# Altium project Netscale48HD_Sensorbar.PrjPcb (part 1 of 2)
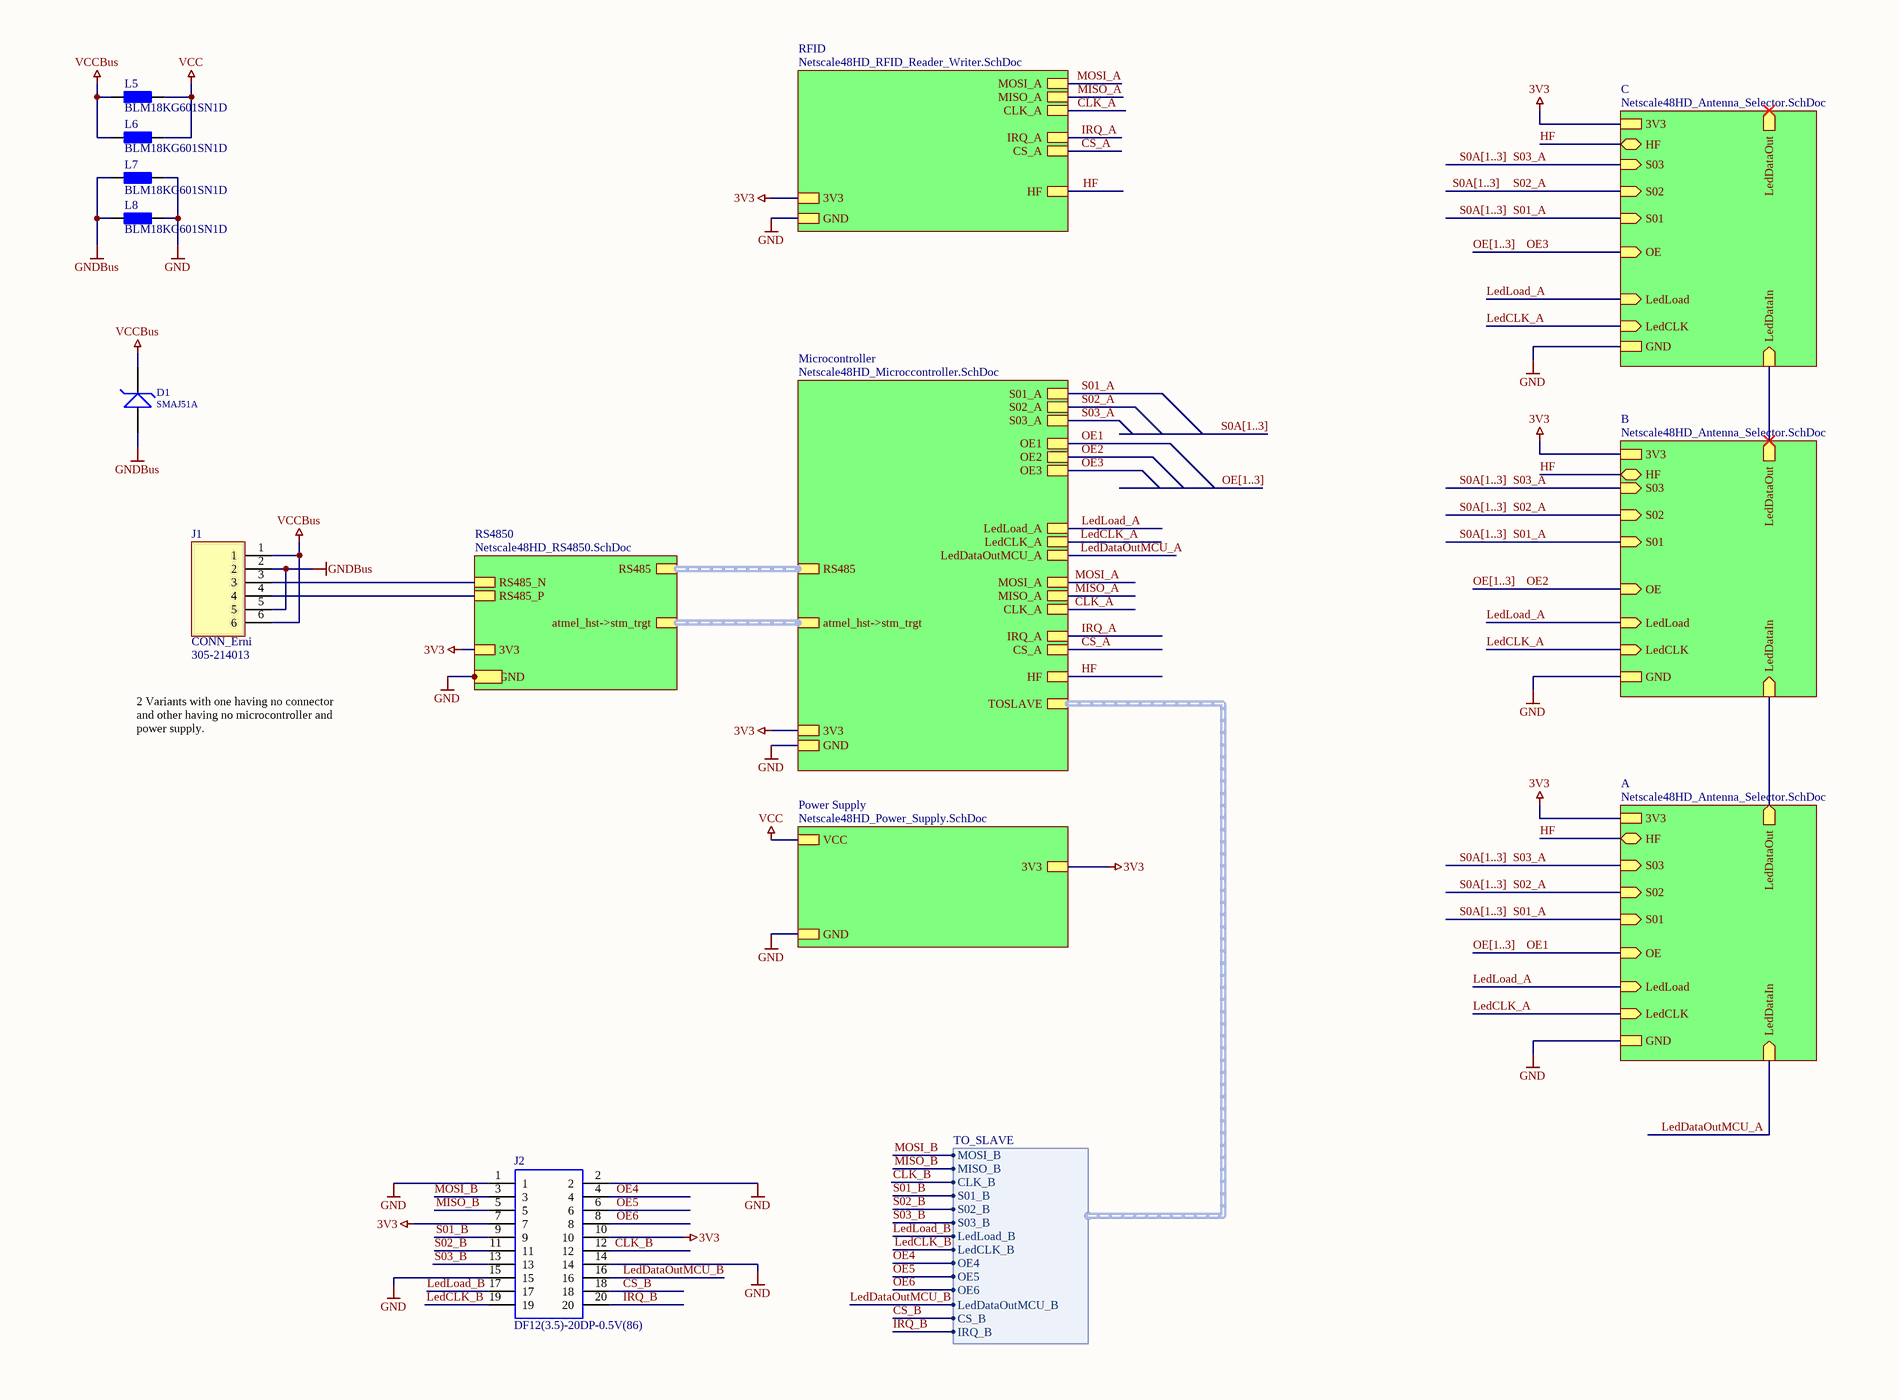
[diagram p0: Netscale48HD_Sensorbar.SchDoc, top]
6 sheets, 299 parts. Net scope: hierarchical (ports join the sheet entries above them; power ports are global).
Board file: Netscale48HD_Sensorbar_Master.PcbDoc
Sheets:
  Netscale48HD_Sensorbar.SchDoc
    Microcontroller = Netscale48HD_Microccontroller.SchDoc
    RS4850 = Netscale48HD_RS4850.SchDoc
    A = Netscale48HD_Antenna_Selector.SchDoc
    B = Netscale48HD_Antenna_Selector.SchDoc
    C = Netscale48HD_Antenna_Selector.SchDoc
    RFID = Netscale48HD_RFID_Reader_Writer.SchDoc
    Power Supply = Netscale48HD_Power_Supply.SchDoc

## Sheet Netscale48HD_Sensorbar.SchDoc: Sensorbar Master Overall Schematic
size A3; CompanyName: Reichle & De-Massari; Organization: Reichle & De-Massari; Address1: Binzstrasse 32; Address2: 8620 Wetzikon; Address3: Switzerland; DocumentNumber: 1; Revision: V0.2; SheetNumber: 1; SheetTotal: 5

### Parts
D1  SMAJ51A  [Bourns_DO-214AC (SMA) small_2_R]
J1  CONN_Erni  Supplier Part Number 1: 305-214013  [ERNI_214013 Randmontage_6_R]
J2  DF12(3.5)-20DP-0.5V(86)  [DF12(4.0)-20DP]
L5  BLM18KG601SN1D  [CAP-0603[1608] - RFL]
L6  BLM18KG601SN1D  [CAP-0603[1608] - RFL]
L7  BLM18KG601SN1D  [CAP-0603[1608] - RFL]
L8  BLM18KG601SN1D  [CAP-0603[1608] - RFL]

### Sub-sheets
A = Netscale48HD_Antenna_Selector.SchDoc: 3V3, S03 (in), S02 (in), S01 (in), HF (bidir), LedLoad (in), LedCLK (in), GND, LedDataOut (out), LedDataIn (in), OE (in)
B = Netscale48HD_Antenna_Selector.SchDoc: 3V3, S03 (in), S02 (in), S01 (in), HF (bidir), LedLoad (in), LedCLK (in), GND, LedDataOut (out), LedDataIn (in), OE (in)
C = Netscale48HD_Antenna_Selector.SchDoc: 3V3, S03 (in), S02 (in), S01 (in), HF (bidir), LedLoad (in), LedCLK (in), GND, LedDataOut (out), LedDataIn (in), OE (in)
Microcontroller = Netscale48HD_Microccontroller.SchDoc: GND, LedLoad_A, RS485 (harness RS485), 3V3, LedCLK_A, LedDataOutMCU_A, CS_A, S01_A, S02_A, S03_A, OE1, OE2, OE3, IRQ_A, HF, atmel_hst->stm_trgt (harness atmel_hst->stm_trgt), MOSI_A, MISO_A, CLK_A, TOSLAVE (harness TO_SLAVE)
Power Supply = Netscale48HD_Power_Supply.SchDoc: VCC, GND, 3V3
RFID = Netscale48HD_RFID_Reader_Writer.SchDoc: MOSI_A, MISO_A, 3V3, GND, IRQ_A, HF, CS_A, CLK_A
RS4850 = Netscale48HD_RS4850.SchDoc: GND, 3V3, RS485 (harness RS485), RS485_N, RS485_P, atmel_hst->stm_trgt (harness atmel_hst->stm_trgt)

### Ports


### Harnesses
TO_SLAVE: MOSI_B, MISO_B, CLK_B, S01_B, S02_B, S03_B, LedLoad_B, LedCLK_B, OE4, OE5, OE6, LedDataOutMCU_B, CS_B, IRQ_B

### Nets
3V3: J2.7 J2.10 ; sheet Microcontroller/3V3, sheet RS4850/3V3, sheet A/3V3, sheet B/3V3, sheet C/3V3, sheet RFID/3V3, sheet Power Supply/3V3
GND: J2.1 J2.2 J2.14 J2.15 L7.2 L8.2 ; port , sheet Microcontroller/GND, sheet RS4850/GND, sheet A/GND, sheet B/GND, sheet C/GND, sheet RFID/GND, sheet Power Supply/GND
GNDBus: D1.2(A) J1.2 J1.5 L7.1 L8.1
VCC: L5.2 L6.2 ; sheet Power Supply/VCC
VCCBus: D1.1(K) J1.1 J1.6 L5.1 L6.1
CLK_A: sheet Microcontroller/CLK_A, sheet RFID/CLK_A
CLK_B: J2.12 ; sheet Microcontroller/TOSLAVE.CLK_B
CS_A: sheet Microcontroller/CS_A, sheet RFID/CS_A
CS_B: J2.18 ; sheet Microcontroller/TOSLAVE.CS_B
HF: sheet Microcontroller/HF, sheet A/HF, sheet B/HF, sheet C/HF, sheet RFID/HF
IRQ_A: sheet Microcontroller/IRQ_A, sheet RFID/IRQ_A
IRQ_B: J2.20 ; sheet Microcontroller/TOSLAVE.IRQ_B
LedCLK_A: sheet Microcontroller/LedCLK_A, sheet A/LedCLK, sheet B/LedCLK, sheet C/LedCLK  [project net LedCLK]
LedCLK_B: J2.19 ; sheet Microcontroller/TOSLAVE.LedCLK_B
LedDataIn: sheet A/LedDataOut, sheet B/LedDataIn
LedDataIn: sheet B/LedDataOut, sheet C/LedDataIn  [a separate net that carries the same name]
LedDataOutMCU_A: sheet Microcontroller/LedDataOutMCU_A, sheet A/LedDataIn  [project net LedDataIn]
LedDataOutMCU_B: J2.16 ; sheet Microcontroller/TOSLAVE.LedDataOutMCU_B
LedLoad_A: sheet Microcontroller/LedLoad_A, sheet A/LedLoad, sheet B/LedLoad, sheet C/LedLoad  [project net LedLoad]
LedLoad_B: J2.17 ; sheet Microcontroller/TOSLAVE.LedLoad_B
MISO_A: sheet Microcontroller/MISO_A, sheet RFID/MISO_A
MISO_B: J2.5 ; sheet Microcontroller/TOSLAVE.MISO_B
MOSI_A: sheet Microcontroller/MOSI_A, sheet RFID/MOSI_A
MOSI_B: J2.3 ; sheet Microcontroller/TOSLAVE.MOSI_B
OE1: sheet Microcontroller/OE1, sheet A/OE  [project net OE]
OE2: sheet Microcontroller/OE2, sheet B/OE  [project net OE]
OE3: sheet Microcontroller/OE3, sheet C/OE  [project net OE]
OE4: J2.4 ; sheet Microcontroller/TOSLAVE.OE4
OE5: J2.6 ; sheet Microcontroller/TOSLAVE.OE5
OE6: J2.8 ; sheet Microcontroller/TOSLAVE.OE6
RS485_0_N: J1.3 ; sheet RS4850/RS485_N
RS485_0_P: J1.4 ; sheet RS4850/RS485_P
S01_A: sheet Microcontroller/S01_A, sheet A/S01, sheet B/S01, sheet C/S01  [project net S01]
S01_B: J2.9 ; sheet Microcontroller/TOSLAVE.S01_B
S02_A: sheet Microcontroller/S02_A, sheet A/S02, sheet B/S02, sheet C/S02  [project net S02]
S02_B: J2.11 ; sheet Microcontroller/TOSLAVE.S02_B
S03_A: sheet Microcontroller/S03_A, sheet A/S03, sheet B/S03, sheet C/S03  [project net S03]
S03_B: J2.13 ; sheet Microcontroller/TOSLAVE.S03_B

### Buses and harness runs
bus OE[1..3]
bus S0A[1..3]
harness sheet Microcontroller/atmel_hst->stm_trgt = sheet RS4850/atmel_hst->stm_trgt
harness sheet Microcontroller/RS485 = sheet RS4850/RS485

### Notes on the sheet
- 10,8
- 16,8
- 7
- 212,4
- 2 Variants with one having no connector and other having no microcontroller and power supply.
- Title
- Size:
- Date:
- A3
- Number:
- Time:
- Revision:
- Sheet
- of
- File:

### Library data of the parts
D1 = Diode_SMAJ51A: ESD Suppressors / TVS Diodes 51volts 5uA 4.9 Amps Uni-Dir; Manufacturer: Bourns; Replaceable: yes; Manufacturer PartNr: SMAJ51A; ShortDescription: SMAJ51A; Footprint/Package: DO-214AC-2 (SMA); Supplier 1: Mouser; Supplier Part Number 1: 652-SMAJ51A; value: SMAJ51A
J1 = CONN_Erni_6_214013: Headers & Wire Housings 6P 1.27MM SNGL ROW R/A MALE BLK; Manufacturer: ERNI; Manufacturer PartNr: 214013; Replaceable: no; ComponentLink1Description: mouser; ComponentLink1URL: https://www.mouser.ch/ProductDetail/ERNI/214013?qs=sGAEpiMZZMvMXbh32ZmHAMhEPQG9jaj7Ou3J%2fuOb4IQ%3d; Footprint/Package: 1.27mm; Supplier 1: Mouser
J2 = DF12(3.5)-20DP-0.5V(86): Connector,Board to Board,DF12 Hirose DF12 Series, 0.5mm Pitch 20 Way 2 Row Straight PCB Header, Solder Termination, 0.3A; Allied_Number: R1051072; Manufacturer_Name: Hirose; Manufacturer_Part_Number: DF12(3.5)-20DP-0.5V(86); RS Part Number: 6082064P; RS Price/Stock: http://uk.rs-online.com/web/p/products/6082064P; Allied Price/Stock: http://www.alliedelec.com/hirose-electric-df12-3-5-20dp-0-5v-86-/R1051072/; Mouser Part Number: 798-DF123520DP0.5V86; Mouser Price/Stock: https://www.mouser.com/Search/Refine.aspx?Keyword=798-DF123520DP0.5V86; Datasheet Link: https://www.hirose.com/product/en/download_file/key_name/DF12/category/Catalog/doc_file_id/31693/?file_category_id=4&item_id=23&is_series=1.pdf; Supplier 1: Digi-Key; Supplier 1 Part Number 1: H5230TR-ND
L5-L8 = Ferrite Beads: Chip Ferrite Bead; Manufacturer: Murata; Manufacturer PartNr: BLM18KG601SN1D; ShortDescription: BLM18KG601SN1D

## Sheet Netscale48HD_Microccontroller.SchDoc: STM32 Microcontroller
size A3; Organization: Reichle & De-Massari; Address1: Binzstrasse 32; Address2: 8620 Wetzikon; Address3: Switzerland; DocumentNumber: 5; Revision: V0.2; SheetNumber: 5; SheetTotal: 5
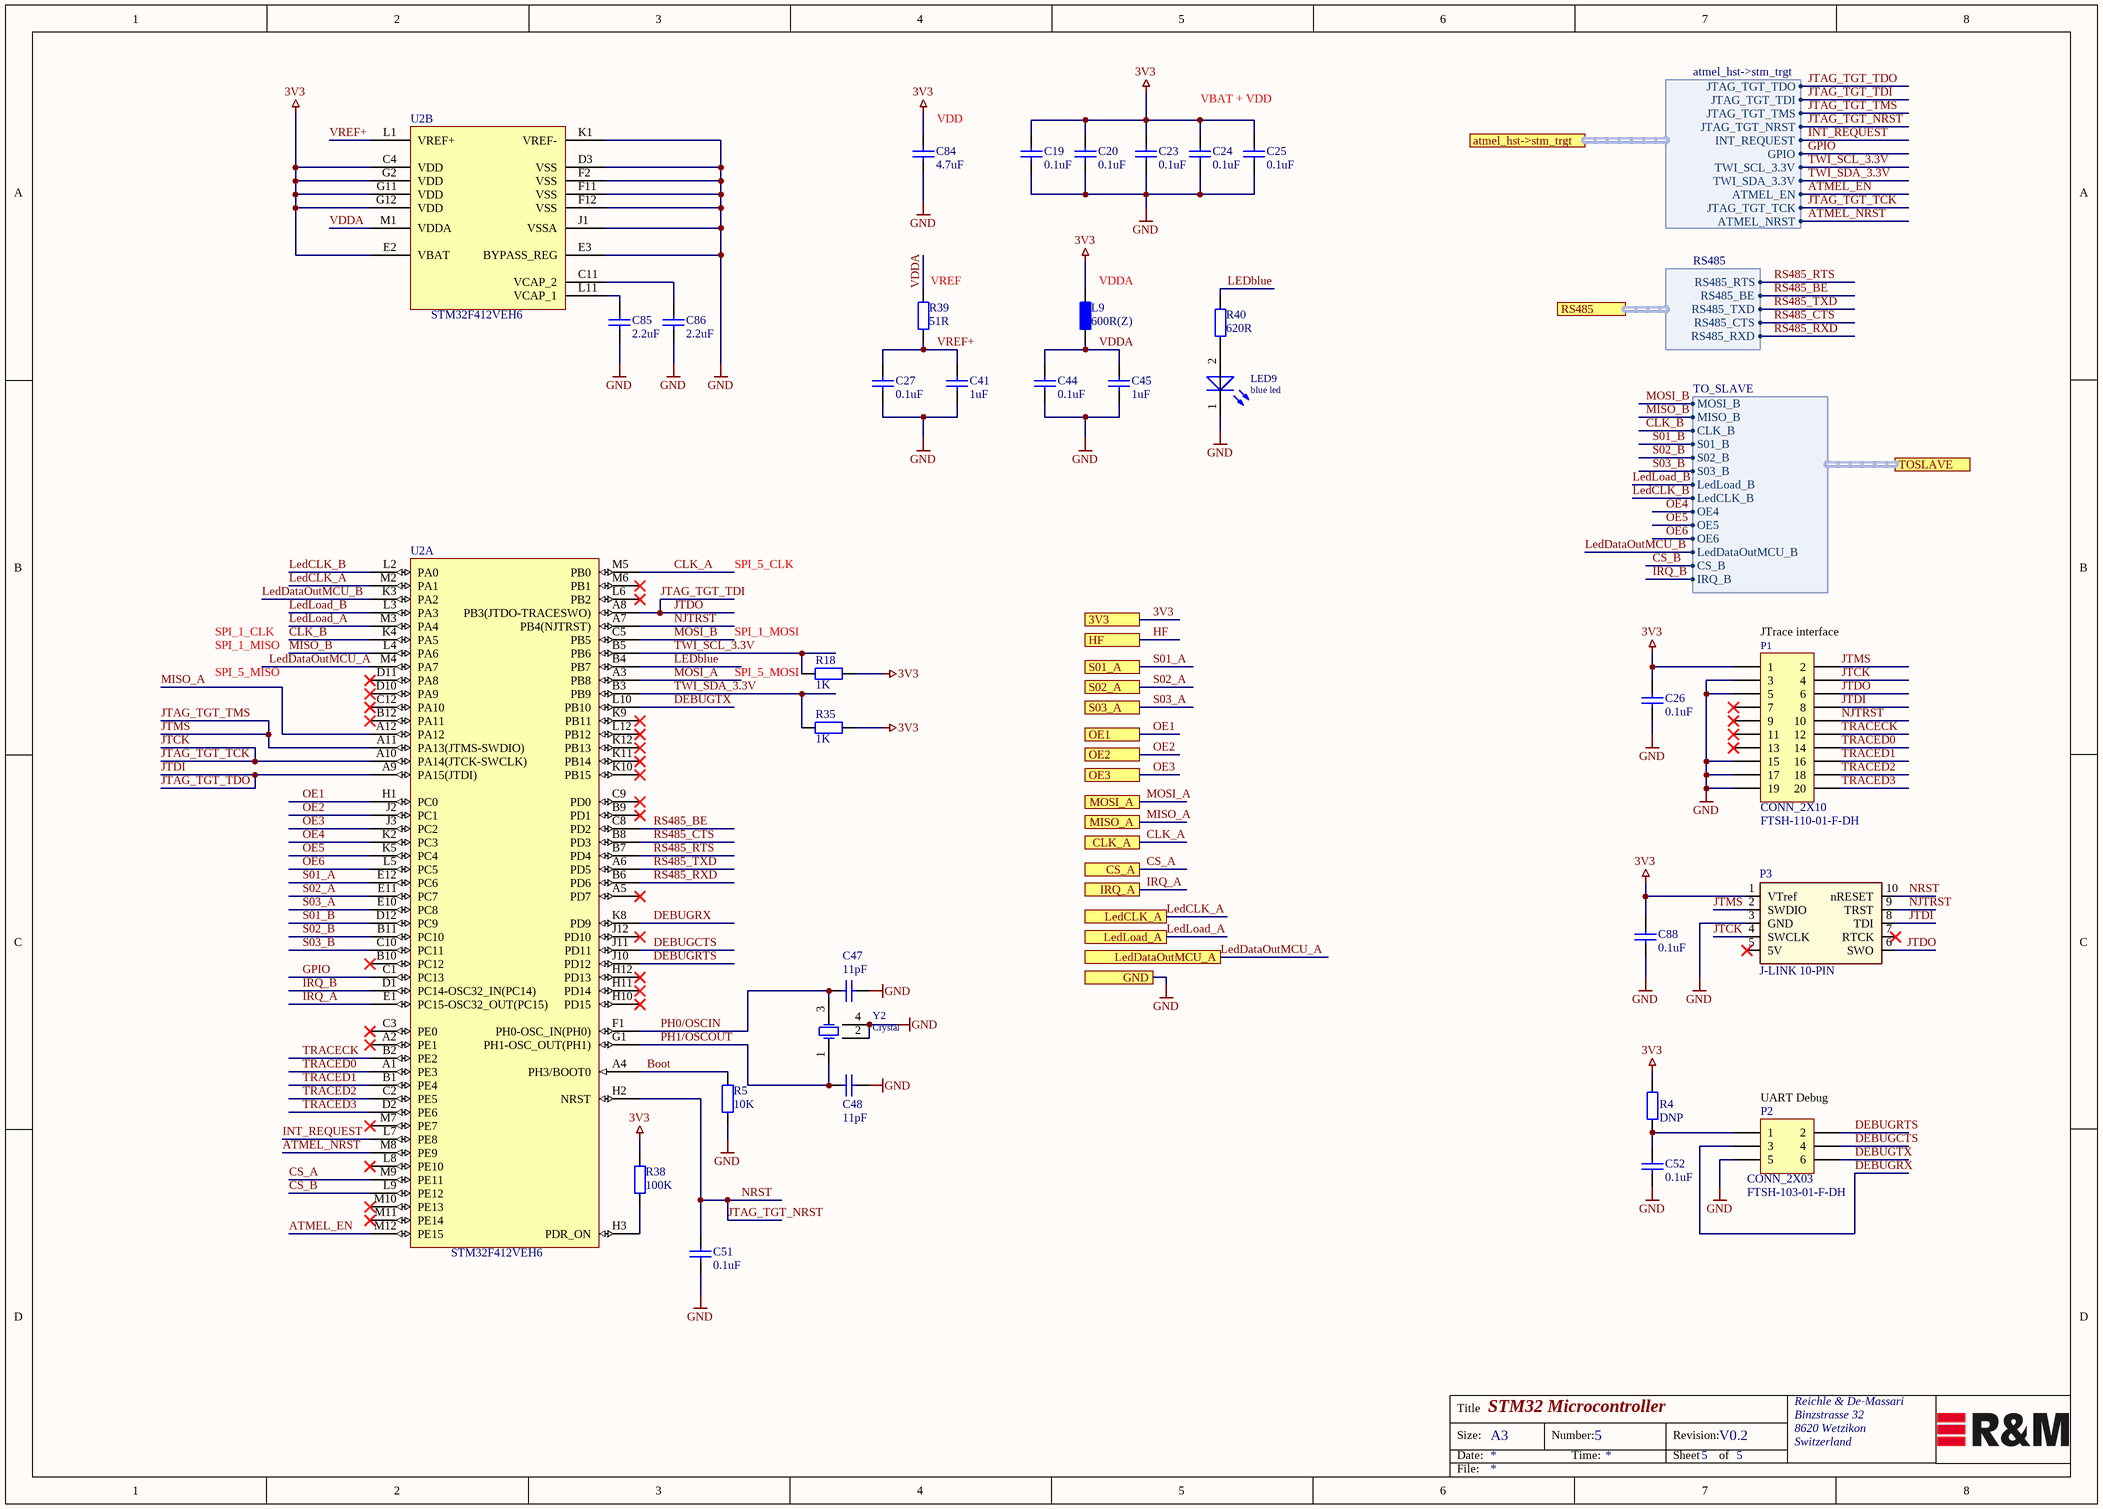
[diagram p1: Netscale48HD_Microccontroller.SchDoc]

### Parts
C19  0.1uF  [Ceramic Capacitor 0402 EIA]
C20  0.1uF  [Ceramic Capacitor 0402 EIA]
C23  0.1uF  [Ceramic Capacitor 0402 EIA]
C24  0.1uF  [Ceramic Capacitor 0402 EIA]
C25  0.1uF  [Ceramic Capacitor 0402 EIA]
C26  0.1uF  [CAPC1005X55N]
C27  0.1uF  [Ceramic Capacitor 0402 EIA]
C41  1uF  [Ceramic Capacitor 0402 EIA]
C44  0.1uF  [Ceramic Capacitor 0402 EIA]
C45  1uF  [Ceramic Capacitor 0402 EIA]
C47  11pF  [CAPC0402(1005)60_L]
C48  11pF  [CAPC0402(1005)60_L]
C51  0.1uF  [Ceramic Capacitor 0402 EIA]
C52  0.1uF  [Ceramic Capacitor 0402 EIA]
C84  4.7uF  [Ceramic Capacitor 0603 EIA]
C85  2.2uF  [Ceramic Capacitor 0402 EIA]
C86  2.2uF  [Ceramic Capacitor 0402 EIA]
C88  0.1uF  [Ceramic Capacitor 0402 EIA]
L9  600R(Z)  [Inductor 0603 EIA]
LED9  blue led  [Kingbright_SMD_2_RWH]
P1  CONN_2X10  [FTSH-110-01-F-DH]
P2  CONN_2X03  [FTSH-103-01-F-DH]
P3  J-LINK 10-PIN  [CONN-SEGGER-10-PIN]
R4  DNP  [RESC1005X40N]
R5  10K  [RES-0402[1005] - RFL]
R18  1K  [Resistor 0402 EIA]
R35  1K  [Resistor 0402 EIA]
R38  100K  [Resistor 0402 EIA]
R39  51R  [Resistor 0402 EIA]
R40  620R  [Resistor 0402 EIA]
U2  STM32F412VEH6  [STM_UFBGA100 7x7x0.6_100_R]  (parts A,B of 2)
Y2  Crystal  [ECS_ECX-2236_4_R]

### Ports
3V3, atmel_hst->stm_trgt (harness atmel_hst->stm_trgt), CLK_A, CS_A, GND, HF, IRQ_A, LedCLK_A, LedDataOutMCU_A, LedLoad_A, MISO_A, MOSI_A, OE1, OE2, OE3, RS485 (harness RS485), S01_A, S02_A, S03_A, TOSLAVE (harness TO_SLAVE)

### Harnesses
atmel_hst->stm_trgt: JTAG_TGT_TDO, JTAG_TGT_TDI, JTAG_TGT_TMS, JTAG_TGT_NRST, INT_REQUEST, GPIO, TWI_SCL_3.3V, TWI_SDA_3.3V, ATMEL_EN, JTAG_TGT_TCK, ATMEL_NRST
RS485: RS485_RXD, RS485_CTS, RS485_TXD, RS485_BE, RS485_RTS
TO_SLAVE: MOSI_B, MISO_B, CLK_B, S01_B, S02_B, S03_B, LedLoad_B, LedCLK_B, OE4, OE5, OE6, LedDataOutMCU_B, CS_B, IRQ_B

### Nets
3V3: C19.2 C20.2 C23.2 C24.2 C25.2 C26.2 C84.2 C88.2 L9.1 P1.1 P3.1(VTref) R4.2 R18.2 R35.2 R38.1 U2.C4(VDD) U2.E2(VBAT) U2.G2(VDD) U2.G11(VDD) U2.G12(VDD) ; port 3V3
GND: C19.1 C20.1 C23.1 C24.1 C25.1 C26.1 C27.1 C41.1 C44.1 C45.1 C47.2 C48.2 C51.1 C52.1 C84.1 C85.1 C86.1 C88.1 LED9.1(K) P1.3 P1.5 P1.15 P1.17 P1.19 P2.5 P3.3(GND) R5.2 U2.D3(VSS) U2.E3(BYPASS_REG) U2.F2(VSS) U2.F11(VSS) U2.F12(VSS) U2.J1(VSSA) U2.K1(VREF-) Y2.2(OSC2) Y2.4(OSC3) ; port GND
ATMEL_EN: U2.M12(PE15) ; port atmel_hst->stm_trgt.ATMEL_EN
ATMEL_NRST: U2.M8(PE9) ; port atmel_hst->stm_trgt.ATMEL_NRST
Boot: R5.1 U2.A4(PH3/BOOT0)
CLK_A: U2.M5(PB0) ; port CLK_A
CLK_B: U2.K4(PA5) ; port TOSLAVE.CLK_B
CS_A: U2.M9(PE11) ; port CS_A
CS_B: U2.L9(PE12) ; port TOSLAVE.CS_B
DEBUGCTS: P2.4 U2.J11(PD11)
DEBUGRTS: P2.2 U2.J10(PD12)
DEBUGRX: P2.3 U2.K8(PD9)
DEBUGTX: P2.6 U2.L10(PB10)
GPIO: U2.C1(PC13) ; port atmel_hst->stm_trgt.GPIO
INT_REQUEST: U2.L7(PE8) ; port atmel_hst->stm_trgt.INT_REQUEST
IRQ_A: U2.E1(PC15-OSC32_OUT(PC15)) ; port IRQ_A
IRQ_B: U2.D1(PC14-OSC32_IN(PC14)) ; port TOSLAVE.IRQ_B
JTAG_TGT_NRST: C51.2 P3.10(nRESET) U2.H2(NRST) ; port atmel_hst->stm_trgt.JTAG_TGT_NRST  [also labelled NRST]
JTAG_TGT_TCK: P1.4 P3.4(SWCLK) U2.A10(PA14(JTCK-SWCLK)) ; port atmel_hst->stm_trgt.JTAG_TGT_TCK  [also labelled JTCK]
JTAG_TGT_TDI: P1.6 P3.6(SWO) U2.A8(PB3(JTDO-TRACESWO)) ; port atmel_hst->stm_trgt.JTAG_TGT_TDI  [also labelled JTDO]
JTAG_TGT_TDO: P1.8 P3.8(TDI) U2.A9(PA15(JTDI)) ; port atmel_hst->stm_trgt.JTAG_TGT_TDO  [also labelled JTDI]
JTAG_TGT_TMS: P1.2 P3.2(SWDIO) U2.A11(PA13(JTMS-SWDIO)) ; port atmel_hst->stm_trgt.JTAG_TGT_TMS  [also labelled JTMS]
LEDblue: R40.1 U2.B4(PB7)
LedCLK_A: U2.M2(PA1) ; port LedCLK_A  [project net LedCLK]
LedCLK_B: U2.L2(PA0) ; port TOSLAVE.LedCLK_B
LedDataOutMCU_A: U2.M4(PA7) ; port LedDataOutMCU_A  [project net LedDataIn]
LedDataOutMCU_B: U2.K3(PA2) ; port TOSLAVE.LedDataOutMCU_B
LedLoad_A: U2.M3(PA4) ; port LedLoad_A  [project net LedLoad]
LedLoad_B: U2.L3(PA3) ; port TOSLAVE.LedLoad_B
MISO_A: U2.A12(PA12) ; port MISO_A
MISO_B: U2.L4(PA6) ; port TOSLAVE.MISO_B
MOSI_A: U2.A3(PB8) ; port MOSI_A
MOSI_B: U2.C5(PB5) ; port TOSLAVE.MOSI_B
NJTRST: P1.10 P3.9(TRST) U2.A7(PB4(NJTRST))
OE1: U2.H1(PC0) ; port OE1  [project net OE]
OE2: U2.J2(PC1) ; port OE2  [project net OE]
OE3: U2.J3(PC2) ; port OE3  [project net OE]
OE4: U2.K2(PC3) ; port TOSLAVE.OE4
OE5: U2.K5(PC4) ; port TOSLAVE.OE5
OE6: U2.L5(PC5) ; port TOSLAVE.OE6
PH0/OSCIN: C47.1 U2.F1(PH0-OSC_IN(PH0)) Y2.3(OSC2)
PH1/OSCOUT: C48.1 U2.G1(PH1-OSC_OUT(PH1)) Y2.1(OSC1)
RS485_BE: U2.C8(PD2) ; port RS485.RS485_BE
RS485_CTS: U2.B8(PD3) ; port RS485.RS485_CTS
RS485_RTS: U2.B7(PD4) ; port RS485.RS485_RTS
RS485_RXD: U2.B6(PD6) ; port RS485.RS485_RXD
RS485_TXD: U2.A6(PD5) ; port RS485.RS485_TXD
S01_A: U2.E12(PC6) ; port S01_A  [project net S01]
S01_B: U2.D12(PC9) ; port TOSLAVE.S01_B
S02_A: U2.E11(PC7) ; port S02_A  [project net S02]
S02_B: U2.B11(PC10) ; port TOSLAVE.S02_B
S03_A: U2.E10(PC8) ; port S03_A  [project net S03]
S03_B: U2.C10(PC11) ; port TOSLAVE.S03_B
TRACECK: P1.12 U2.B2(PE2)
TRACED0: P1.14 U2.A1(PE3)
TRACED1: P1.16 U2.B1(PE4)
TRACED2: P1.18 U2.C2(PE5)
TRACED3: P1.20 U2.D2(PE6)
TWI_SCL_3.3V: R18.1 U2.B5(PB6) ; port atmel_hst->stm_trgt.TWI_SCL_3.3V
TWI_SDA_3.3V: R35.1 U2.B3(PB9) ; port atmel_hst->stm_trgt.TWI_SDA_3.3V
VDDA: C44.2 C45.2 L9.2 R39.1 U2.M1(VDDA)
VREF+: C27.2 C41.2 R39.2 U2.L1(VREF+)
NetC52_2: C52.2 P2.1 R4.1
NetC85_2: C85.2 U2.L11(VCAP_1)
NetC86_2: C86.2 U2.C11(VCAP_2)
NetLED9_2: LED9.2(A) R40.2
NetR38_2: R38.2 U2.H3(PDR_ON)

Not connected (* = marked no-connect by the designer): P1 7* 9* 11* 13*; P3 5(5V)* 7(RTCK)*; U2 A2(PE1)* A5(PD7)* B9(PD1)* B10(PC12)* B12(PA11)* C3(PE0)* C9(PD0)* C12(PA10)* D10(PA9)* D11(PA8)* H10(PD15)* H11(PD14)* H12(PD13)* J12(PD10)* K9(PB11)* K10(PB15)* K11(PB14)* K12(PB13)* L6(PB2)* L8(PE10)* L12(PB12)* M6(PB1)* M7(PE7)* M10(PE13)* M11(PE14)*

### Notes on the sheet
- VBAT + VDD
- (near C84) VDD
- (near R39) VREF
- (near L9) VDDA
- SPI_5_CLK
- SPI_1_CLK
- SPI_1_MISO
- (near R18) SPI_1_MOSI
- (near P1) JTrace interface
- SPI_5_MISO
- (near R18) SPI_5_MOSI
- (near P2) UART Debug
- Title
- Size:
- Date:
- A3
- Number:
- Time:
- Revision:
- Sheet
- of
- File:

### Library data of the parts
C19 C20 C23-C25 C27 C44 C51 C88 = Cap_0.1uF_0402: SMD/SMT WCAP-CSGP 0.1uF 0402 20% 10V MLCC; Manufacturer: Wurth Electronics; Manufacturer PartNr: 885012105010; voltage: 10VDC; Replaceable: yes; Dielectric Grade: X5R; value: 0.1uF; tolerance: 20%; Footprint/Package: 0402; ComponentLink1Description: mouser; ComponentLink1URL: https://www.mouser.ch/ProductDetail/Wurth-Electronics/885012105010?qs=sGAEpiMZZMs0AnBnWHyRQEGbLOF2VP1ihL84oCjXnlO407YOHi%2fQbw%3d%3d; Supplier 1: Mouser; Supplier 2: Farnell; Supplier 3: Digi-Key; Supplier Part Number 1: 710-885012105010; Supplier Part Number 2: 2533928; Supplier Part Number 3: 732-7487-1-ND
C26 C52 = Cap_0.1uF_0402: SMD/SMT WCAP-CSGP 0.1uF 0402 20% 10V MLCC; Manufacturer: Wurth Electronics; Manufacturer PartNr: 885012105010; voltage: 10VDC; Dielectric Grade: X5R; Replaceable: yes; value: 0.1uF; tolerance: 20%; ComponentLink1Description: mouser; ComponentLink1URL: https://www.mouser.ch/ProductDetail/Wurth-Electronics/885012105010?qs=sGAEpiMZZMs0AnBnWHyRQEGbLOF2VP1ihL84oCjXnlO407YOHi%2fQbw%3d%3d; Footprint/Package: 0402; Supplier 1: Mouser; Supplier 2: Farnell; Supplier Part Number 1: 710-885012105010; Supplier Part Number 2: 2533928; Supplier 3: Digi-Key; Supplier Part Number 3: 732-7487-1-ND
C41 C45 = Cap_1uF_0402: SMD/SMT 0402 1uF 10volts X7S 10%; Manufacturer: Murata; Manufacturer PartNr: GCM155C71A105KE38D; voltage: 10VDC; Replaceable: yes; value: 1uF; tolerance: 10%; Footprint/Package: 0402 (1005 metric); Dielectric Grade: X7S; ComponentLink1Description: mouser; ComponentLink1URL: https://www.mouser.ch/ProductDetail/Murata-Electronics/GCM155C71A105KE38D?qs=sGAEpiMZZMsh%252b1woXyUXj0FEAttKcN54ouz5zO04smg%3d; Supplier Part Number 1: 490-13409-1-ND; Supplier 1: Digi-Key
C47 C48 = Cap_11pF_0402: SMD/SMT 0402 11pF 50volts C0G 5%; Manufacturer: Murata; Manufacturer PartNr: GRM1555C1H110JA01D; voltage: 50VDC; Dielectric Grade: C0G (NP0); Replaceable: yes; value: 11pF; tolerance: 5%; ComponentLink1Description: mouser; ComponentLink1URL: https://www.mouser.ch/ProductDetail/Murata-Electronics/GRM1555C1H110JA01D?qs=%2fha2pyFadug34NHqLs7eMMmZ4IY%2fB%2fBwtGmZmE%252bqlNJIuNiWKDU4cio3ILTIjZ7Z; Footprint/Package: 0402; Supplier 1: Mouser; Supplier 2: Digi-Key; Supplier 3: Farnell; Supplier Part Number 1: 81-GRM1555C1H110JA1D; Supplier Part Number 2: 490-5923-6-ND; Supplier Part Number 3: 2218837
C84 = Cap_4.7uF_0603: SMD/SMT 0603 4.7uF 10volts; Manufracturer: Murata; Manufacturer PartNr: GRM188R61A475KE15D; tolerance: 20%; voltage: 10VDC; Replaceable: yes; Dielectric Grade: X5R; value: 4.7uF; Footprint/Package: 0603
C85 C86 = Cap_2.2uF_0402: 2.2µF ±20% 25V Ceramic Capacitor X5R 0402 (1005 Metric); Manufacturer: Murata; Manufacturer PartNr: GRM155R61E225ME15D; Replaceable: yes; value: 2.2uF; tolerance: ±20%; voltage: 25V; Dielectric Grade: X5R; Footprint/Package: 0402; ComponentLink1Description: digikey; ComponentLink1URL: https://www.digikey.com/product-detail/en/murata-electronics-north-america/GRM155R61E225ME15D/490-10457-2-ND/5027542
L9 = Ind_600R_0603: Ferritperlen MULTILYR CHP BD 0603 600OHMS 25%; Manufacturer: Taiyo Yuden; Manufacturer PartNr: BK1608HS601-T; Replaceable: yes; current: 350mA; value: 600R(Z); tolerance: 25%; power: *; Footprint/Package: 0603; Supplier 1: Mouser; Supplier Part Number 1: 963-BK1608HS601-T
LED9 = APA1606VBC/D: blue, 1.6 x 0.6 mm Right Angle SMD Chip LED Lamp; Manufacturer: Kingbright; Replaceable: yes; Manufacturer PartNr: APA1606VBC/D; ComponentLink1Description: mouser; ComponentLink1URL: https://www.mouser.ch/ProductDetail/Kingbright/APA1606VBC-D?qs=%2fha2pyFaduhFkLoQLKawdk3E%252bl3FgSOr3Fif4NOc1lJmKkWDM5WlaQ%3d%3d; Footprint/Package: specific, see datasheet; Supplier 1: Digi-Key; Supplier Part Number 1: 754-2090-6-ND
P1 = CONN_2X10_FTSH-110-01-F-DH: 20Pin, 2Rows, side/horizontally, MICRO LOW-PROFILE TERMINAL STRIPS; Manufacturer: Samtec; Replaceable: no; Manufacturer PartNr: FTSH-110-01-F-DH; ComponentLink1Description: mouser; ComponentLink1URL: https://www.mouser.ch/ProductDetail/Samtec/FTSH-110-02-F-DH?qs=sGAEpiMZZMs%252bGHln7q6pm8Vn94ktop%2fJX5D4YaS%252bHqWex9Ov5NBeXw%3d%3d; Footprint/Package: 1.27 mm; Supplier 1: Digi-Key; Supplier 2: Farnell; Supplier 3: Mouser; Supplier Part Number 1: SAM11236-ND; Supplier Part Number 2: 2856415; Supplier Part Number 3: 200-FTS11002FDV
P2 = CONN_2X03_FTSH-103-01-F-DH: 6Pin, 2Rows, MICRO LOW-PROFILE TERMINAL STRIPS; Manufacturer: Samtec; Replaceable: no; Manufacturer PartNr: FTSH-103-01-F-DH; Footprint/Package: 1.27 mm
P3 = CONN_Segger_10_PIN: Segger, J-Link 10-pin Needle Adapter
R4 = Res_DNP_0402: Resistor: do not populate; Replaceable: no; value: DNP; tolerance: *; power: *; Manufacturer: do not populate; Manufacturer PartNr: do not populate; Footprint/Package: 0402
R5 = PassResBas0402-00623-A.3: 10K 0.063W 1% 0402 (1005 Metric)  SMD; Manufacturer: Yageo; Manufacturer PartNr: RC0402FR-0710KL; Replaceable: yes; value: 10K; tolerance: ±1%; Footprint/Package: 0402; Supplier 1: Digi-Key; Supplier Part Number 1: 311-10.0KLRCT-ND; Power: 0.063W
R18 R35 = Res_1K_0402: Thick Film Resistors - SMD CRGCQ 0402 1K0 1% SMD Resistor; Manufacturer: TE Connectivity; Manufacturer PartNr: CRGCQ0402F1K0; power: 1/16W; Replaceable: yes; value: 1K; tolerance: ±1%; Footprint/Package: 0402 (1005 metric); Supplier 1: Digi-Key; Supplier Part Number 1: A129627CT-ND; Supplier 2: Mouser; Supplier Part Number 2: 279-CRGCQ0402F1K0
R38 = Res_100K_0402: 100 kOhm Resistor 0402; Manufacturer: Vishay; Manufacturer PartNr: CRCW0402100KJNEDC; power: 63mW; Replaceable: yes; value: 100K; tolerance: -; Footprint/Package: 0402
R39 = Res_51R_0402: Resistor; Manufacturer: Yageo; Manufacturer PartNr: RC0402JR-0751RL; tolerance: 5%; power: 62.5mW; Replaceable: yes; value: 51R; Footprint/Package: 0402; ComponentLink1Description: mouser; ComponentLink1URL: https://www.mouser.ch/ProductDetail/Yageo/RC0402JR-0751RL?qs=sGAEpiMZZMtG0KNrPCHnjTtiZEI2zSDg2UFCMmEjZXQ%3d; Supplier 1: Farnell; Supplier 2: Mouser; Supplier 3: Digi-Key; Supplier Part Number 1: 1799298; Supplier Part Number 2: 603-RC0402JR-0751RL; Supplier Part Number 3: 311-51JRDKR-ND
R40 = Res_620R_0402: SMD 1/16W 620ohm 0.5%; Manufacturer: Susumu; Manufacturer PartNr: RR0510P-621-D; power: 62.5mW; Replaceable: yes; value: 620R; tolerance: 0.5%; Footprint/Package: 0402; ComponentLink1Description: mouser; ComponentLink1URL: https://www.mouser.ch/ProductDetail/Susumu/RR0510P-621-D?qs=sGAEpiMZZMu61qfTUdNhG%2fDhcyQpRg8MIBVoO7KVzPo%3d; Supplier 1: Mouser; Supplier 2: Digi-Key; Supplier Part Number 1: 754-RR0510P-621D; Supplier Part Number 2: RR05P620DDKR-ND
U2 = STM_STM32F412VEH6_UFBGA100 7x7x0.6_100: STM32 Dynamic Efficiency MCU with BAM, High-performance and DSP with FPU, ARM Cortex-M4 MCU with 512 Kbytes Flash, 100 MHz CPU, Art Accelerator, DFSDM; Manufacturer: STMicroelectronics; Replaceable: no; ComponentLink1Description: mouser; ComponentLink1URL: https://www.mouser.ch/ProductDetail/STMicroelectronics/STM32L431VCI6?qs=%2fha2pyFadugH5aS8CDb9Mm3u%252bAbg7zIVJiWcYxu1pWKDX51qWwrkAQ%3d%3d; Manufacturer PartNr: STM32F412VEH6; Footprint/Package: UFBGA-100; Supplier 1: Digi-Key; Supplier 2: Mouser; Supplier Part Number 1: STM32F412VEH6-ND; Supplier Part Number 2: 511-STM32F412VEH6
Y2 = ECS-240-10-36-CKL-TR: Quarz 24MHz-10pF 10ppm-10C +70C; Manufacturer: ECS; Replaceable: No; Load Capacitance: 10pF; Manufacturer Part Number: ECS-240-10-36-CKL-TR; Manufacturer PartNr: ECS-240-10-36-CKL-TR; Supplier 1: Mouser; Supplier Part Number 1: 520-240-10-36-CKLT; Footprint/Package: specific, see datasheet

## Sheet Netscale48HD_RS4850.SchDoc: RS4850 Transceiver
size A3; Organization: Reichle & De-Massari; Address1: Binzstrasse 32; Address2: 8620 Wetzikon; Address3: Switzerland; DocumentNumber: 4; Revision: V0.2; SheetNumber: 4; SheetTotal: 5
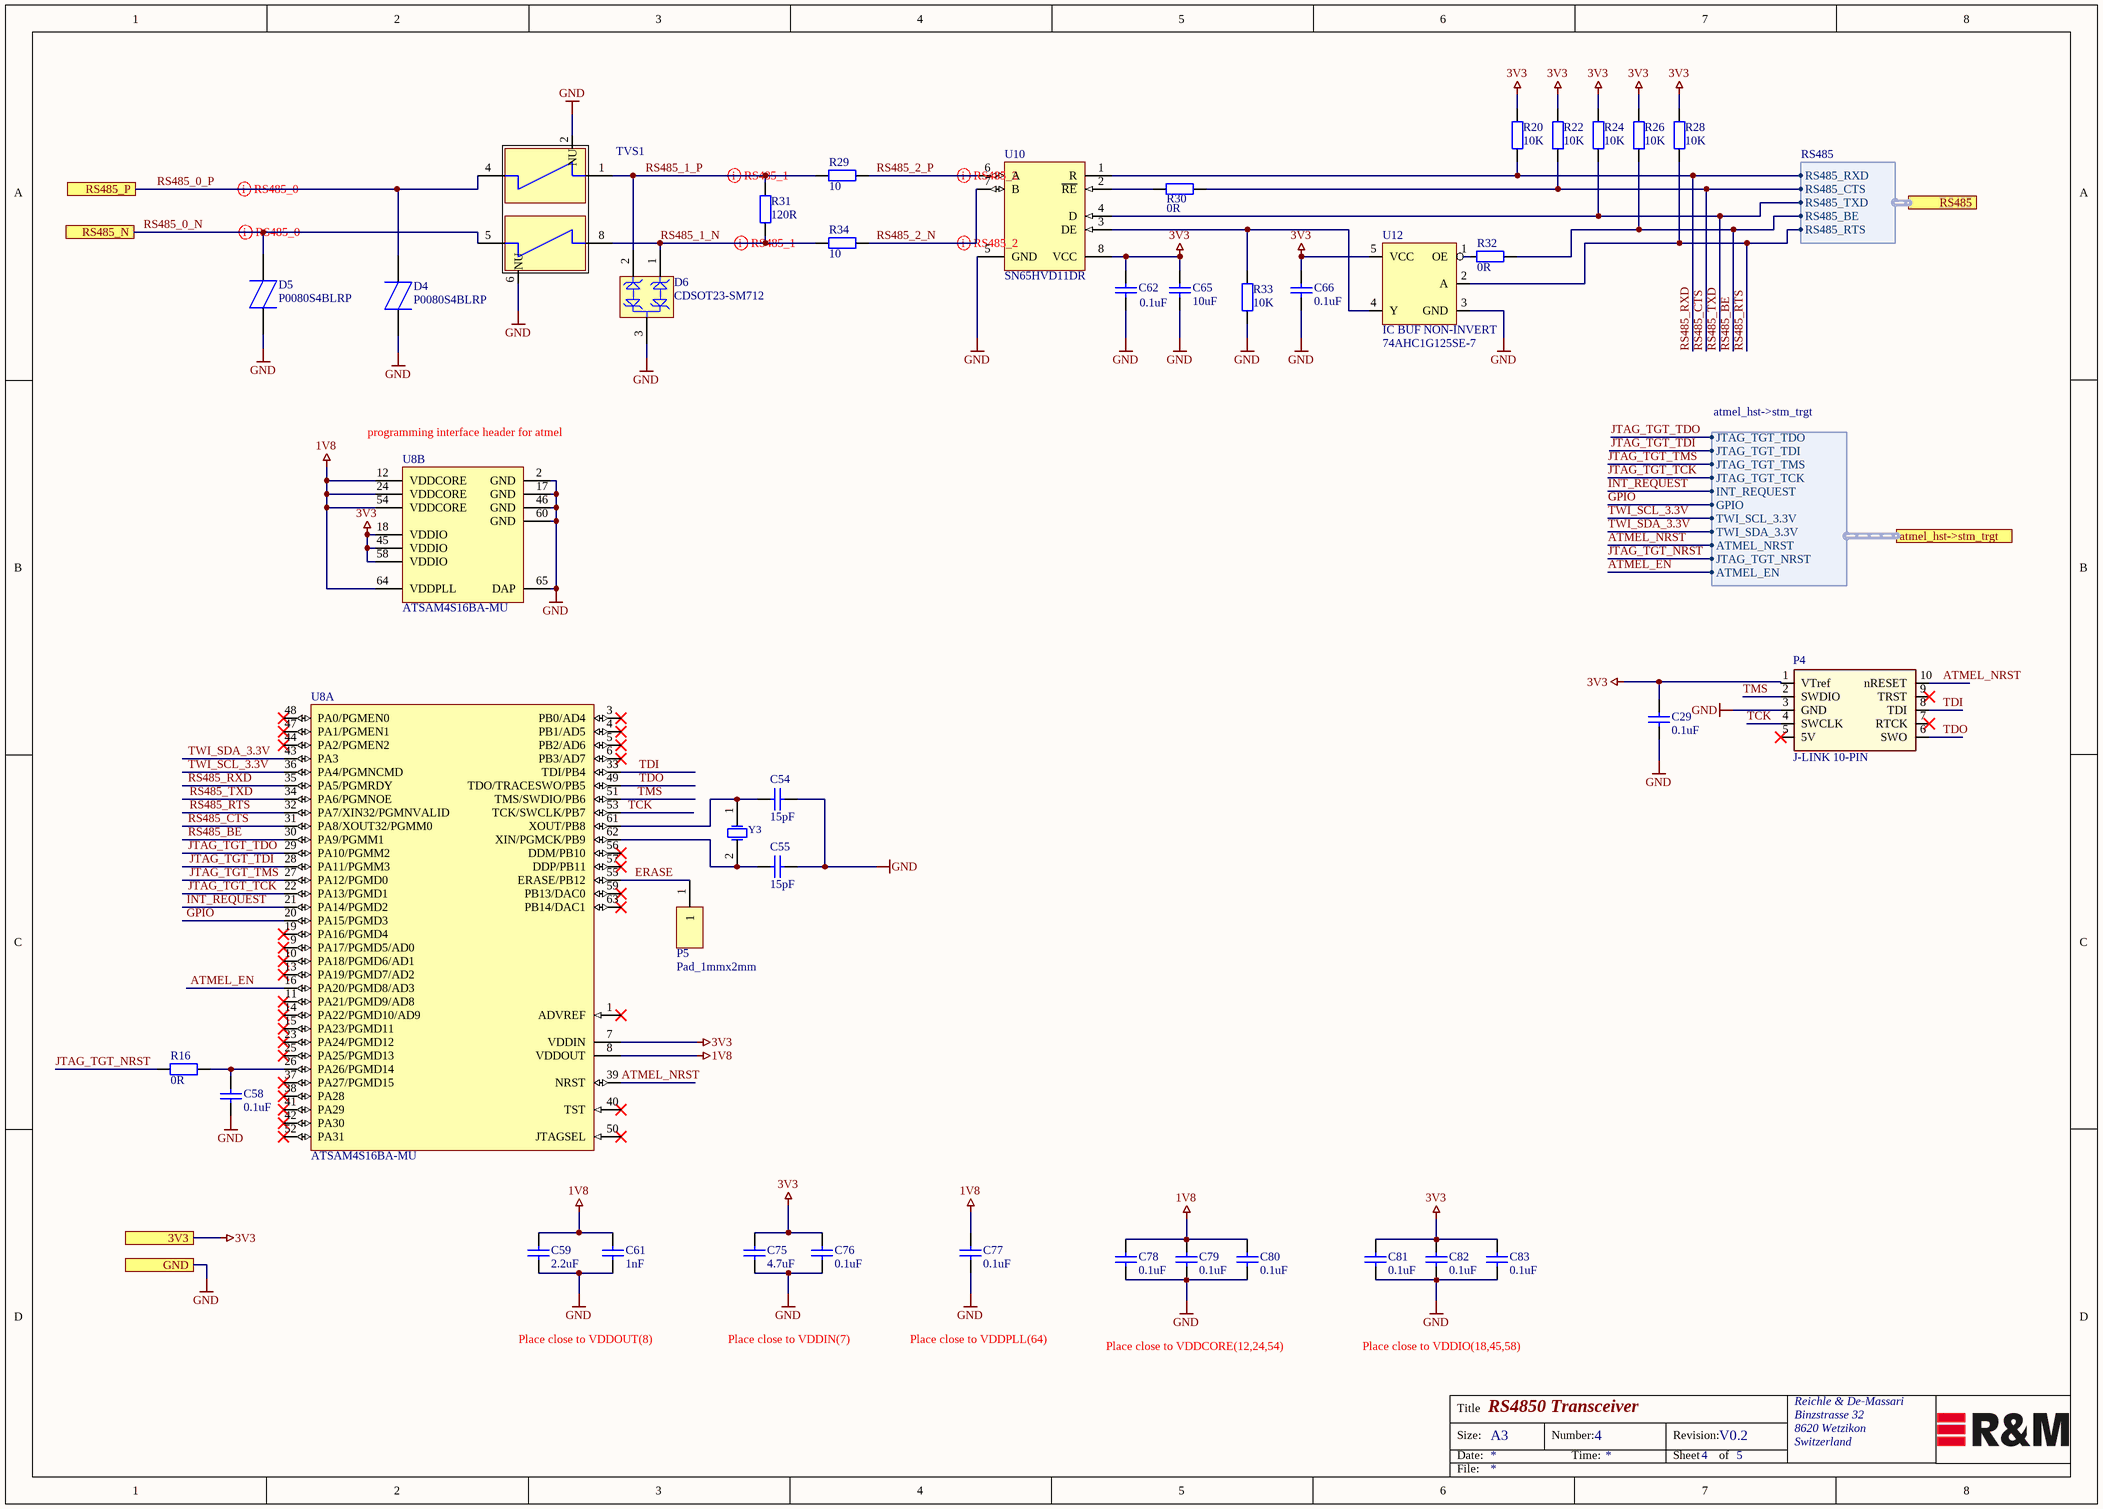
[diagram p2: Netscale48HD_RS4850.SchDoc]

### Parts
C29  0.1uF  [Ceramic Capacitor 0402 EIA]
C54  15pF  [Ceramic Capacitor 0402 EIA]
C55  15pF  [Ceramic Capacitor 0402 EIA]
C58  0.1uF  [Ceramic Capacitor 0402 EIA]
C59  2.2uF  [Ceramic Capacitor 0402 EIA]
C61  1nF  [Ceramic Capacitor 0402 EIA]
C62  0.1uF  [Ceramic Capacitor 0402 EIA]
C65  10uF  [Ceramic Capacitor 0402 EIA]
C66  0.1uF  [Ceramic Capacitor 0402 EIA]
C75  4.7uF  [Ceramic Capacitor 0603 EIA]
C76  0.1uF  [Ceramic Capacitor 0402 EIA]
C77  0.1uF  [Ceramic Capacitor 0402 EIA]
C78  0.1uF  [Ceramic Capacitor 0402 EIA]
C79  0.1uF  [Ceramic Capacitor 0402 EIA]
C80  0.1uF  [Ceramic Capacitor 0402 EIA]
C81  0.1uF  [Ceramic Capacitor 0402 EIA]
C82  0.1uF  [Ceramic Capacitor 0402 EIA]
C83  0.1uF  [Ceramic Capacitor 0402 EIA]
D4  P0080S4BLRP  [P0080S4BLRP]
D5  P0080S4BLRP  [P0080S4BLRP]
D6  CDSOT23-SM712  [BOUR-SOT23-3_V]
P4  J-LINK 10-PIN  [CONN-SEGGER-10-PIN]
P5  Pad_1mmx2mm  [Pad_1mmx2mm]
R16  0R  [Resistor 0402 EIA]
R20  10K  [Resistor 0402 EIA]
R22  10K  [Resistor 0402 EIA]
R24  10K  [Resistor 0402 EIA]
R26  10K  [Resistor 0402 EIA]
R28  10K  [Resistor 0402 EIA]
R29  10  [RES-0603[1608] - RFL]
R30  0R  [Resistor 0402 EIA]
R31  120R  [RES-0402[1005] - RFL]
R32  0R  [Resistor 0402 EIA]
R33  10K  [Resistor 0402 EIA]
R34  10  [RES-0603[1608] - RFL]
TVS1  TBU-CA065-200-WH  [Bourns_TBU_PL060_WH]  (value not drawn)
U8  ATSAM4S16BA-MU  [64PS_N]  (parts A,B of 2)
U10  SN65HVD11DR  [TI_D (R-PDSO-G8)_8_R]
U12  IC BUF NON-INVERT  [SOT353]
Y3  ABM3-12.000MHZ-B2-T  [ABM3-12.000MHZ-B2-T]  (value not drawn)

### Ports
3V3, atmel_hst->stm_trgt (harness atmel_hst->stm_trgt), GND, RS485 (harness RS485), RS485_N, RS485_P

### Harnesses
RS485: RS485_RXD, RS485_CTS, RS485_TXD, RS485_BE, RS485_RTS
atmel_hst->stm_trgt: JTAG_TGT_TDO, JTAG_TGT_TDI, JTAG_TGT_TMS, JTAG_TGT_NRST, INT_REQUEST, GPIO, TWI_SCL_3.3V, TWI_SDA_3.3V, ATMEL_EN, JTAG_TGT_TCK, ATMEL_NRST

### Nets
1V8: C59.2 C61.2 C77.2 C78.2 C79.2 C80.2 U8.8(VDDOUT) U8.12(VDDCORE) U8.24(VDDCORE) U8.54(VDDCORE) U8.64(VDDPLL)
3V3: C29.2 C62.1 C65.2 C66.1 C75.2 C76.2 C81.2 C82.2 C83.2 P4.1(VTref) R20.2 R22.2 R24.2 R26.2 R28.2 U8.7(VDDIN) U8.18(VDDIO) U8.45(VDDIO) U8.58(VDDIO) U10.8(VCC) U12.5(VCC) ; port 3V3
GND: C29.1 C54.1 C55.1 C58.1 C59.1 C61.1 C62.2 C65.1 C66.2 C75.1 C76.1 C77.1 C78.1 C79.1 C80.1 C81.1 C82.1 C83.1 D4.1(A) D5.1(A) D6.3 P4.3(GND) R33.1 TVS1.2(NU) TVS1.6(NU) U8.2(GND) U8.17(GND) U8.46(GND) U8.60(GND) U8.65(DAP) U10.5(GND) U12.3(GND) ; port GND
ATMEL_EN: U8.16(PA20/PGMD8/AD3) ; port atmel_hst->stm_trgt.ATMEL_EN
ATMEL_NRST: P4.10(nRESET) U8.39(NRST) ; port atmel_hst->stm_trgt.ATMEL_NRST
ERASE: P5.1 U8.55(ERASE/PB12)
GPIO: U8.20(PA15/PGMD3) ; port atmel_hst->stm_trgt.GPIO
INT_REQUEST: U8.21(PA14/PGMD2) ; port atmel_hst->stm_trgt.INT_REQUEST
JTAG_TGT_NRST: R16.1 ; port atmel_hst->stm_trgt.JTAG_TGT_NRST
JTAG_TGT_TCK: U8.22(PA13/PGMD1) ; port atmel_hst->stm_trgt.JTAG_TGT_TCK
JTAG_TGT_TDI: U8.28(PA11/PGMM3) ; port atmel_hst->stm_trgt.JTAG_TGT_TDI
JTAG_TGT_TDO: U8.29(PA10/PGMM2) ; port atmel_hst->stm_trgt.JTAG_TGT_TDO
JTAG_TGT_TMS: U8.27(PA12/PGMD0) ; port atmel_hst->stm_trgt.JTAG_TGT_TMS
RS485_0_N: D5.2(K) TVS1.5 ; port RS485_N
RS485_0_P: D4.2(K) TVS1.4 ; port RS485_P
RS485_1_N: D6.1 R31.2 R34.2 TVS1.8
RS485_1_P: D6.2 R29.2 R31.1 TVS1.1
RS485_2_N: R34.1 U10.7(B)
RS485_2_P: R29.1 U10.6(A)
RS485_BE: R26.1 R32.2 U8.30(PA9/PGMM1) ; port RS485.RS485_BE
RS485_CTS: R22.1 R30.2 U8.31(PA8/XOUT32/PGMM0) ; port RS485.RS485_CTS
RS485_RTS: R28.1 U8.32(PA7/XIN32/PGMNVALID) U12.2(A) ; port RS485.RS485_RTS
RS485_RXD: R20.1 U8.35(PA5/PGMRDY) U10.1(R) ; port RS485.RS485_RXD
RS485_TXD: R24.1 U8.34(PA6/PGMNOE) U10.4(D) ; port RS485.RS485_TXD
TCK: P4.4(SWCLK) U8.53(TCK/SWCLK/PB7)
TDI: P4.8(TDI) U8.33(TDI/PB4)
TDO: P4.6(SWO) U8.49(TDO/TRACESWO/PB5)
TMS: P4.2(SWDIO) U8.51(TMS/SWDIO/PB6)
TWI_SCL_3.3V: U8.36(PA4/PGMNCMD) ; port atmel_hst->stm_trgt.TWI_SCL_3.3V
TWI_SDA_3.3V: U8.43(PA3) ; port atmel_hst->stm_trgt.TWI_SDA_3.3V
NetC54_2: C54.2 U8.61(XOUT/PB8) Y3.1(OSC1)
NetC55_2: C55.2 U8.62(XIN/PGMCK/PB9) Y3.2(OSC2)
NetC58_2: C58.2 R16.2 U8.26(PA26/PGMD14)
NetR30_1: R30.1 U10.2(~{RE})
NetR32_1: R32.1 U12.1(OE)
NetR33_2: R33.2 U10.3(DE) U12.4(Y)

Not connected (* = marked no-connect by the designer): P4 5(5V)* 7(RTCK)* 9(TRST)*; U8 1(ADVREF)* 3(PB0/AD4)* 4(PB1/AD5)* 5(PB2/AD6)* 6(PB3/AD7)* 9(PA17/PGMD5/AD0)* 10(PA18/PGMD6/AD1)* 11(PA21/PGMD9/AD8)* 13(PA19/PGMD7/AD2)* 14(PA22/PGMD10/AD9)* 15(PA23/PGMD11)* 19(PA16/PGMD4)* 23(PA24/PGMD12)* 25(PA25/PGMD13)* 37(PA27/PGMD15)* 38(PA28)* 40(TST)* 41(PA29)* 42(PA30)* 44(PA2/PGMEN2)* 47(PA1/PGMEN1)* 48(PA0/PGMEN0)* 50(JTAGSEL)* 52(PA31)* 56(DDM/PB10)* 57(DDP/PB11)* 59(PB13/DAC0)* 63(PB14/DAC1)*

### Layout directives
differential pair: RS485_0_N, RS485_0_P, RS485_1_N, RS485_1_P, RS485_2_N, RS485_2_P

### Notes on the sheet
- (near U8) programming interface header for atmel
- Place close to VDDOUT(8)
- Place close to VDDIN(7)
- Place close to VDDPLL(64)
- Place close to VDDCORE(12,24,54)
- Place close to VDDIO(18,45,58)
- Title
- Size:
- Date:
- A3
- Number:
- Time:
- Revision:
- Sheet
- of
- File:

### Library data of the parts
C29 C58 C76-C83 = Cap_0.1uF_0402: as C19 on sheet Netscale48HD_Microccontroller; value: 0.1uF; tolerance: 20%; Footprint/Package: 0402; ComponentLink1Description: mouser; ComponentLink1URL: https://www.mouser.ch/ProductDetail/Wurth-Electronics/885012105010?qs=sGAEpiMZZMs0AnBnWHyRQEGbLOF2VP1ihL84oCjXnlO407YOHi%2fQbw%3d%3d; Supplier 1: Mouser; Supplier 2: Farnell; Supplier 3: Digi-Key; Supplier Part Number 1: 710-885012105010; Supplier Part Number 2: 2533928; Supplier Part Number 3: 732-7487-1-ND
C54 C55 = Cap_15pF_0402: Multilayer Ceramic Capacitors MLCC; Manufacturer: Muarata; Manufacturer PartNr: GJM1555C1H150FB01D; tolerance: ±1%; voltage: 50V; Replaceable: no; Dielectric Grade: NP0; value: 15pF; Footprint/Package: 0402; ComponentLink1Description: digikey; ComponentLink1URL: https://www.digikey.com/product-detail/en/murata-electronics-north-america/GJM1555C1H150FB01D/490-11191-6-ND/5333833
C59 = Cap_2.2uF_0402: as C85 on sheet Netscale48HD_Microccontroller; value: 2.2uF; tolerance: ±20%; voltage: 25V; Dielectric Grade: X5R; Footprint/Package: 0402; ComponentLink1Description: digikey; ComponentLink1URL: https://www.digikey.com/product-detail/en/murata-electronics-north-america/GRM155R61E225ME15D/490-10457-2-ND/5027542
C61 = Cap_1nF_0402: 1000pF ±20% 50V Ceramic Capacitor X5R 0402 (1005 Metric); Manufacturer: TDK Corporation; Manufacturer PartNr: C1005X5R1H102M050BA; Replaceable: yes; value: 1nF; tolerance: ±20%; voltage: 50V; Dielectric Grade: X5R; Footprint/Package: 0402; ComponentLink1Description: digikey; ComponentLink1URL: https://www.digikey.com/product-detail/en/tdk-corporation/C1005X5R1H102M050BA/445-13843-6-ND/3959939
C62 C66 = Cap_0.1uF_0402: as C26 on sheet Netscale48HD_Microccontroller; value: 0.1uF; tolerance: 20%; ComponentLink1Description: mouser; ComponentLink1URL: https://www.mouser.ch/ProductDetail/Wurth-Electronics/885012105010?qs=sGAEpiMZZMs0AnBnWHyRQEGbLOF2VP1ihL84oCjXnlO407YOHi%2fQbw%3d%3d; Footprint/Package: 0402; Supplier 1: Mouser; Supplier 2: Farnell; Supplier 3: Digi-Key; Supplier Part Number 1: 710-885012105010; Supplier Part Number 2: 2533928; Supplier Part Number 3: 732-7487-1-ND
C65 = Cap_10uF_0402: Multilayer Ceramic Capacitors MLCC - SMD/SMT; Manufacturer: Murata; Manufacturer PartNr: ZRB15XR61A106ME01D; tolerance: 20%; voltage: 10VDC; Replaceable: yes; Dielectric Grade: X5R; value: 10uF; ComponentLink1Description: mouser; ComponentLink1URL: https://www.mouser.ch/ProductDetail/Murata-Electronics/ZRB15XR61A106ME01D?qs=sGAEpiMZZMs0AnBnWHyRQN7%2fAA2D2lPPC0%2fdyv23S%2fU%252bBeuYI5b1UA%3d%3d; Footprint/Package: 0402; Supplier 1: Mouser; Supplier Part Number 1: 81-ZRB15XR61A106ME1D
C75 = Cap_4.7uF_0603: as C84 on sheet Netscale48HD_Microccontroller; value: 4.7uF; Footprint/Package: 0603
D4 D5 = P0080S4BLRP: Thyristor Surge Protection Devices (TSPD) PxxxxS4xLRP Series SIDACtor Protection Thyristor 100A 25V Bi SOD; Manufacturer: Littelfuse; Replaceable: no; ComponentLink1Description: mouser; ComponentLink1URL: https://www.mouser.ch/ProductDetail/Diodes-Incorporated/DESD3V3S1BL-7B?qs=%2fha2pyFaduhA707awRoRgtNXj1BWecNQPXz8CtVYm9O48rqwfwJI0g%3d%3d; Footprint/Package: SOD-123FL; Supplier 1: Mouser; Supplier Part Number 1: 576-P0080S4BLRP; Supplier 2: Digikey; Supplier Part Number 2: P0080S4BLRPCT-ND; Manufacturer PartNr: P0080S4BLRP
D6 = Surface Mount TVS Diode: Surface Mount TVS Diode, 17 A Ipp, -55 to 150 degC, 3-Pin SOT23, RoHS, Tape and Reel; Manufacturer: Bourns; Catalog Drawings: CDSOT23-SM712Schematic; Current - Peak Pulse (10/1000µs): 17A(8/20µs); Voltage - Breakdown (Min): 7.5V,13.3V; Online Catalog: CDSOT23Series; Power Line Protection: No; Bidirectional Channels: 2; Type: Zener; For Use With: EVAL-CN0313-SDPZ-ND-EVALEMCRS-485CERTIFIED; Kits: PN-DESIGNKIT-22-ND-KITESD/EFTSURGEPROTECTION; Capacitance @ Frequency: 75pF@1MHz; Product Training Modules: ESDProtectionProducts; Voltage - Clamping (Max) @ Ipp: 14V,26V; Voltage - Reverse Standoff (Typ): 7V(Max),12V(Max); Related Products: ADM3485EARZ-REEL7TR-ND-ICTXRXRS-485HS3.3V8SOICADM3485EARZ-REEL7CT-ND-ICTXRXRS-485HS3.3V8SOICADM3485EARZ-REEL7DKR-ND-ICTXRXRS-485HS3.3V8SOICADM3485EARZ-ND-ICTX/RXRS-485HS3.3V8-SOICADM3485EAR-ND-ICTX/RXRS-485HS3.3V8-SOIC296-38503-5-ND-ICTXRXRS4853.3VESD14SOIC296-38501-5-ND-ICRS485TXRX3.3ESD8SOIC296-38522-5-ND-ICTXRXRS4853.3V14SOIC296-38502-5-ND-ICTXRXRS4853.3VESD14SOICADM3485EARZ-REELTR-ND-ICTXRXRS-4853.3V8SOICADM3485EARZ-REELCT-ND-ICTXRXRS-4853.3V8SOICADM3485EARZ-REELDKR-ND-ICTXRXRS-4853.3V8SOIC296-40517-2-ND-ICTXRXRS4853.3V14SOIC296-40517-1-ND-ICTXRXRS4853.3V14SOIC296-40517-6-ND-ICTXRXRS4853.3V14SOIC296-40519-2-ND-ICRS485TXRX3.3ESD8SOIC296-40519-1-ND-ICRS485TXRX3.3ESD8SOIC296-40519-6-ND-ICRS485TXRX3.3ESD8SOIC296-40524-2-ND-ICTXRXRS4853.3VESD8SOIC296-40524-1-ND-ICTXRXRS4853.3VESD8SOIC296-40524-6-ND-ICTXRXRS4853.3VESD8SOIC296-40522-2-ND-ICTXRXRS4853.3VESD14SOIC296-40522-1-ND-ICTXRXRS4853.3VESD14SOIC296-40522-6-ND-ICTXRXRS4853.3VESD14SOIC296-40529-2-ND-ICRS485TXRX3.3ESD8SOIC296-40529-1-ND-ICRS485TXRX3.3ESD8SOIC2; Other Names: CDSOT23-SM712CT; Power - Peak Pulse: 400W; Replaceable: no; Applications: GeneralPurpose; Supplier Device Package: SOT-23-3; Package / Case: TO-236-3,SC-59,SOT-23-3; Mounting Type: SurfaceMount; Datasheet URL: https://datasheet.ciiva.com/11193/cdsot23-sm712-11193846.pdf; Standard Package: 1; Series: -; Category: CircuitProtection; Unidirectional Channels: -; Package Description: 3-Lead Small Out-Line Transistor, Body 2.9x1.3mm, Pitch 0.95mm; Family: TVS-Diodes; Datasheet Version: Aug-12; Manufacturer URL: http://www.bourns.com/; Operating Temperature: -55degC~150degC(TJ); Packaging: CutTape(CT); value: CDSOT23-SM712; Footprint/Package: DO-214AC-2 (SMA)
P4 = CONN_Segger_10_PIN: Segger, J-Link 10-pin Needle Adapter
R16 = Res_0R_0402: 0 Ohms Resistor 0402; Manufacturer: Panasonic Electronic Components; Manufacturer PartNr: ERJ-2GE0R00X; power: 100mW; Replaceable: yes; value: 0R; tolerance: -; Footprint/Package: 0402 (1005 metric); Supplier 1: Digi-Key; Supplier Part Number 1: P0.0JCT-ND
R20 R22 R24 R26 R28 R33 = Res_10K_0402: SMD 10K ohm 1% 50V General Purpose; Manufacturer: Yageo; Manufacturer PartNr: RC0402FR-1010KL; power: 63mW; Replaceable: yes; value: 10K; tolerance: 1%; ComponentLink1Description: mouser; ComponentLink1URL: https://www.mouser.ch/ProductDetail/Yageo/RC0402FR-1010KL?qs=sGAEpiMZZMtlubZbdhIBIEgN9MQql2m6Sb2LnYlCICU%3d; Footprint/Package: 0402; Supplier 1: Mouser; Supplier Part Number 1: 603-RC0402FR-1010KL
R29 R34 = Res_10R_0603(1608): Thick Film Resistors - SMD 1/4watt 10ohms 1% High Power AEC-Q200; Manufacturer: Vishay; Manufacturer PartNr: CRCW060310R0FKEAHP; Replaceable: yes; voltage: 75 V; power: 250 mW (1/4 W); value: 10; Supplier 1: Mouser; Supplier Part Number 1: 71-CRCW060310R0FKEAH; Footprint/Package: 0603; tolerance: 1 %
R30 R32 = Res_0R_0402: 0 Ohms Jumper 0.1W, 1/10W Chip Resistor 0402 (1005 Metric) Automotive AEC-Q200 Thick Film; Manufacturer: Panasonic Electronic Components; Manufacturer PartNr: ERJ-2GE0R00X; power: 100mW; Replaceable: yes; value: 0R; tolerance: -; Footprint/Package: 0402
R31 = PassResBas0402-00405-A.3: 120 Ohms ±1% 0.063W, 1/16W Chip Resistor 0402 (1005 Metric) Automotive AEC-Q200, Moisture Resistant Thick Film; Manufacturer PartNr: CRGCQ0402F120R; Manufacturer: TE Connectivity; value: 120R; tolerance: 1%; Supplier 1: Digi-Key; Supplier Part Number 1: A129616CT-ND; power: 0.063W
TVS1 = Bourns_TBU-PL060-200-WH: TBU-PL Series dual 50 ohm Surge Suppressors, bi-directional; Manufacturer: Bourns; Replaceable: no; Manufacturer PartNr: TBU-PL060-200-WH; Supplier 1: Mouser; Footprint/Package: DFN; Supplier Part Number 1: 652-TBU-PL060-200-WH; value: TBU-PL060-200-WH
U8 = ATSAM4S16BA-MU: AT91 ARM Cortex-M4 32-bit Microcontroller, 1MB Flash, 128KB SRAM, USB, 79 User I/Os, 64-Pin QFN, Industrial Grade (-40°C to 105°C), Pb-Free; Manufacturer: Atmel; Replaceable: no; DatasheetVersion: revA, Oct-2011; PackageVersion: revJ, Jul-2007; PackageReference: 64PS; PackageDescription: 64-Pin Quad Flat No-Lead (QFN) Sawn, 9 x 9 x 1.0 mm Body, 0.5 mm Pitch, Exposed Pad; Code_JEDEC: MO-220VMMD-3; ComponentLink1Description: Manufacturer URL; ComponentLink1URL: http://www.atmel.com/; ComponentLink2Description: SAM4S Series Datasheet; ComponentLink2URL: http://www.atmel.com/dyn/resources/prod_documents/11100.pdf; ComponentLink3Description: SAM4S Series Summary; ComponentLink3URL: http://www.atmel.com/dyn/resources/prod_documents/11100S.pdf; Manufacturer PartNr: ATSAM4S16BA-MU; Footprint/Package: QFN, 64-Leads, Body 9x9mm, Pitch 0.5mm, Thermal Pad 7.5x7.5mm, IPC Medium Density
U10 = RS_485 Transceivers: 1/1 Transceiver Half RS422, RS485 8-SOIC; Manufacturer: TI; Replaceable: no; Manufacturer PartNr: SN65HVD11DR; ShortDescription: SN65HVD11DR; Supplier 1: Digi-Key; Supplier Part Number 1: 296-31717-1-ND; Footprint/Package: 8-SOIC
U12 = 74AHC1G125SE-7: Buffer, Non-Inverting 1 Element 1 Bit per Element 3-State Output SOT-353; Manufacturer: Diodes Incorporated; Replaceable: no; Footprint/Package: SOT353; ComponentLink1Description: mouser; ComponentLink1URL: https://www.mouser.ch/ProductDetail/Samtec/BBL-103-G-E?qs=sGAEpiMZZMs%252bGHln7q6pm5ZHNJhTjtr3eyJKd0ZImQM%3d; Supplier 2: Mouser; Supplier 1: Digi-Key; Supplier 3: Farnell; Supplier Part Number 1: SAM1104-03-ND; Supplier Part Number 2: 200-SL103G12; Supplier Part Number 3: 2019491; Manufacturer PartNr: 74AHC1G125SE-7
Y3 = CRYSTAL_2Pin_ABM3-12.000MHZ-B2-T: 12MHz ±20ppm Crystal 18pF 60 Ohms 2-SMD, No Lead; Manufacturer: Abracon LLC; Replaceable: no; Manufacturer PartNr: ABM3-12.000MHZ-B2-T; ShortDescription: 12MHz; Footprint/Package: 2-SMD; ComponentLink1Description: digikey; ComponentLink1URL: https://www.digikey.com/product-detail/en/abracon-llc/ABM3-12.000MHZ-B2-T/535-9100-2-ND/675295
P5 = Pad_1mmx2mm: Manufacturer: Pad_1mmx2mm; Manufacturer PartNr: Pad_1mmx2mm

## Sheet Netscale48HD_Antenna_Selector.SchDoc: Antenna Selector & LED
size A3; Author: NK; CompanyName: Reichle & De-Massari; Organization: Reichle & De-Massari; Address1: Binzstrasse 32; Address2: 8620 Wetzikon; Address3: Switzerland; DocumentNumber: 2; Revision: V0.2; SheetNumber: 2; SheetTotal: 2; Organization1: Reichle & De-Massari; Size: A4; ShortDescription: Shift Register for Switches and Leds, multiplexer for Antennas
Used 3 times, as channels A, B, C. Parts and nets are listed once, with the designators drawn on the sheet.
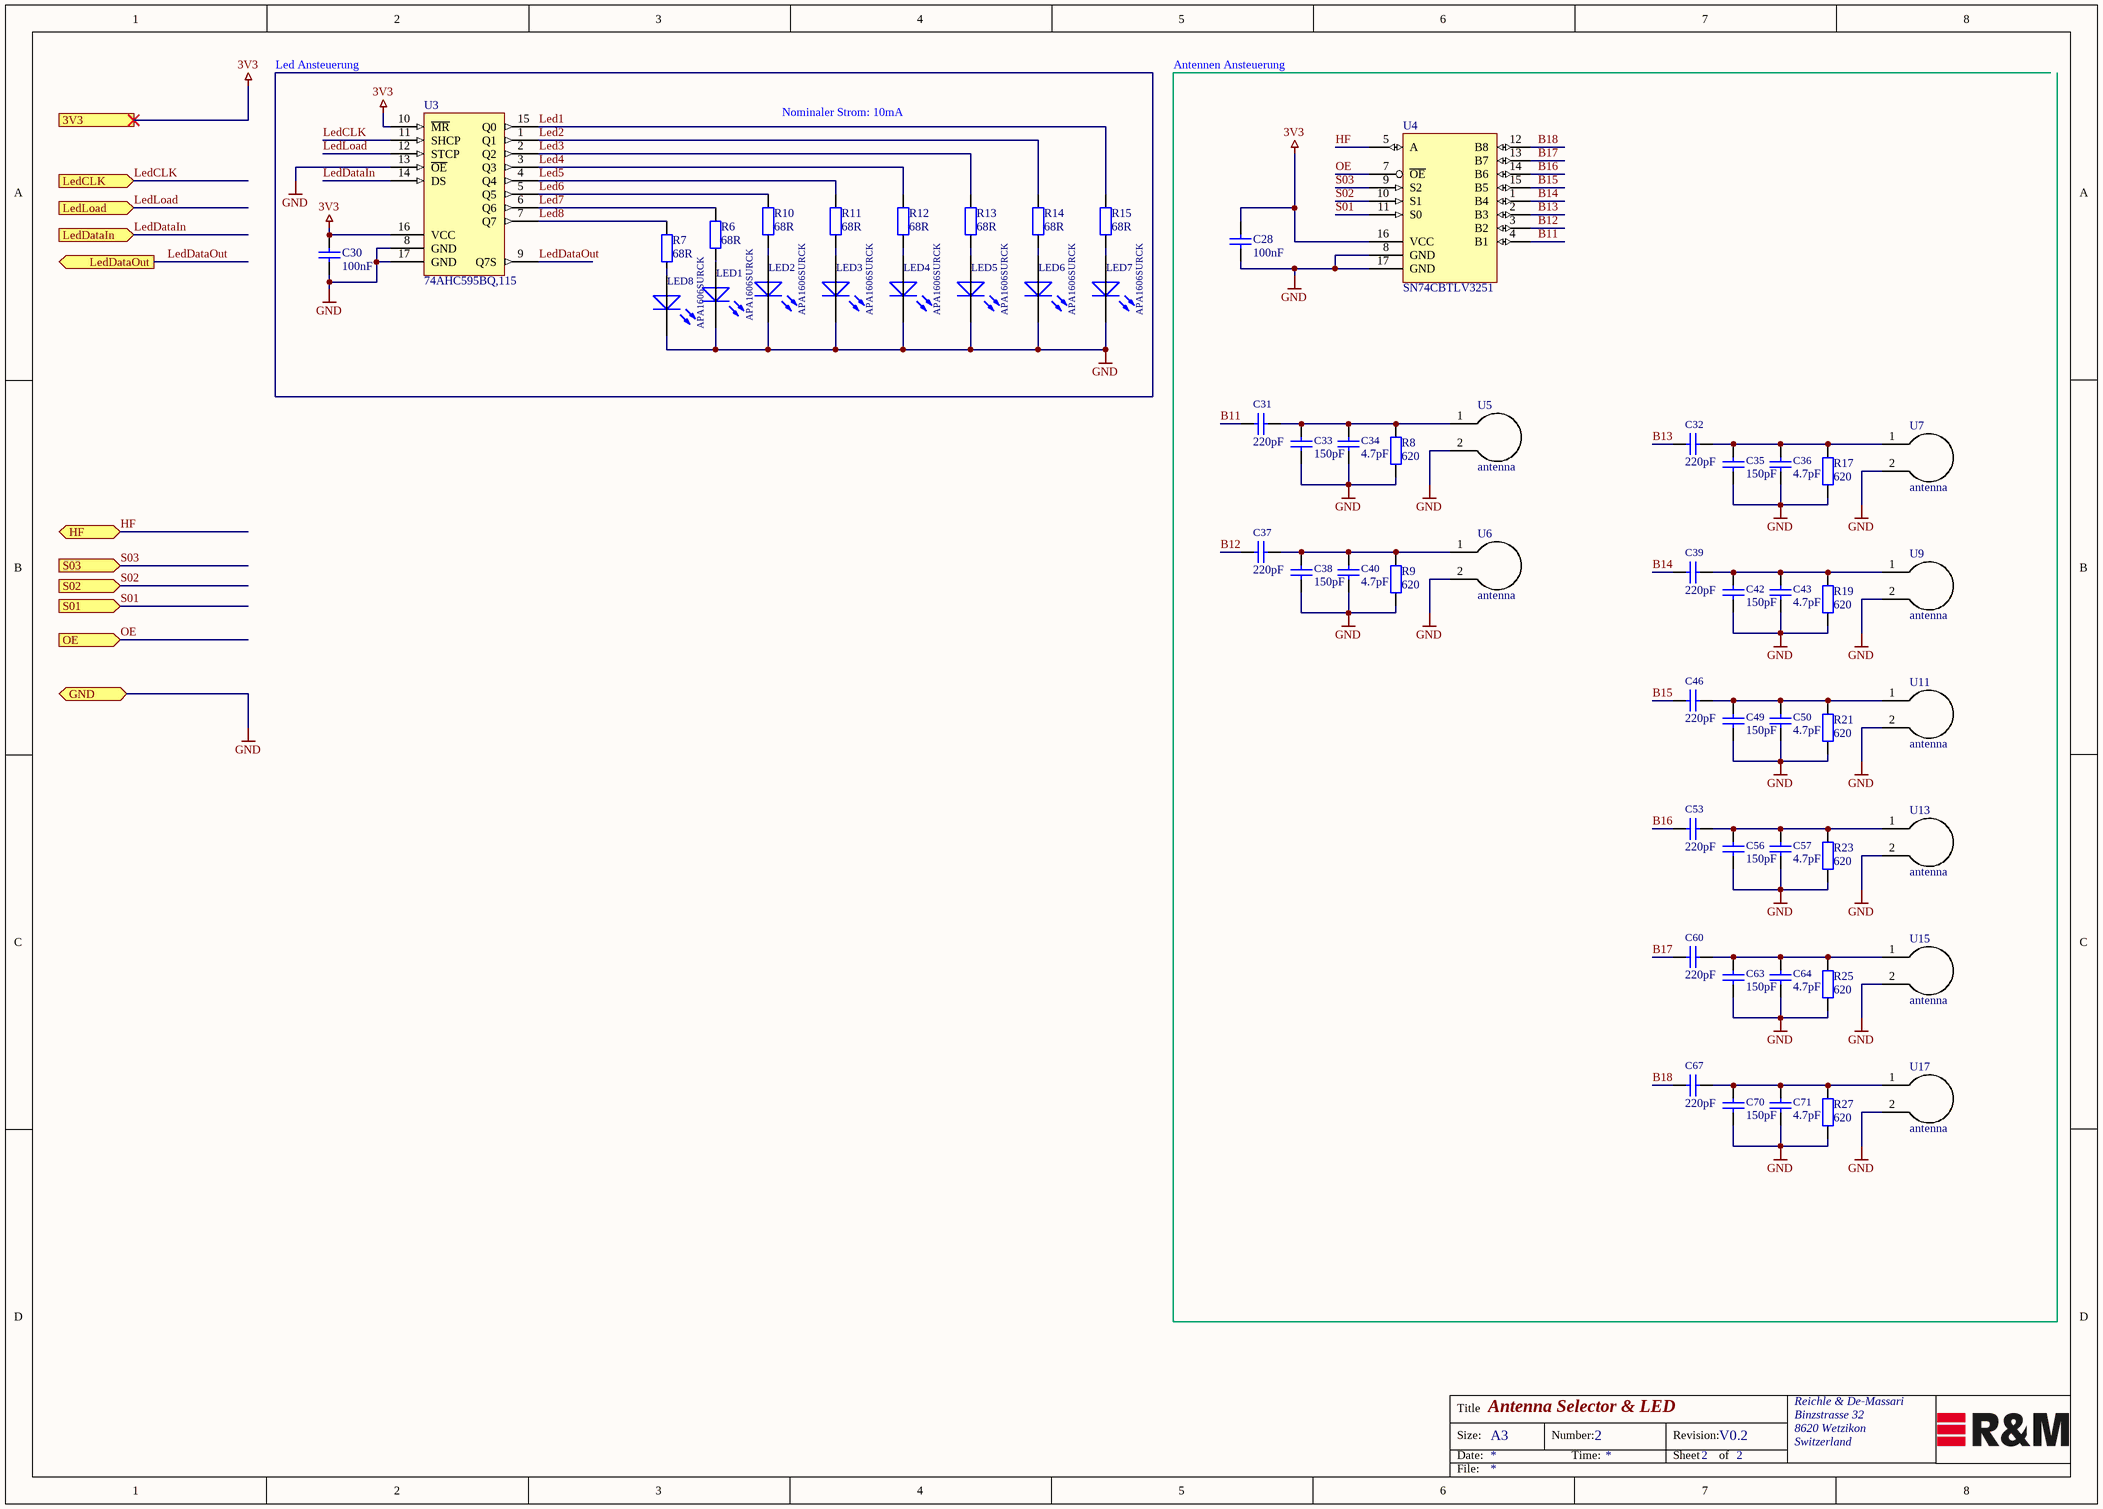
[diagram p3: Netscale48HD_Antenna_Selector.SchDoc]

### Parts
C28  value 100nF  [CAPC1005X55N]  (hidden comment: LMK105BJ104KV-F)
C30  value 100nF  [CAPC1005X55N]  (hidden comment: LMK105BJ104KV-F)
C31  value 220pF  [CAPC1005X55N]  (hidden comment: GCM1555C1H221FA16D)
C32  value 220pF  [CAPC1005X55N]  (hidden comment: GCM1555C1H221FA16D)
C33  value 150pF  [CAPC1005X55N]  (hidden comment: GRM1555C1H151FA01D)
C34  value 4.7pF  [CAPC1005X55N]  (hidden comment: GJM1555C1H4R7WB01D)
C35  value 150pF  [CAPC1005X55N]  (hidden comment: GRM1555C1H151FA01D)
C36  value 4.7pF  [CAPC1005X55N]  (hidden comment: GJM1555C1H4R7WB01D)
C37  value 220pF  [CAPC1005X55N]  (hidden comment: GCM1555C1H221FA16D)
C38  value 150pF  [CAPC1005X55N]  (hidden comment: GRM1555C1H151FA01D)
C39  value 220pF  [CAPC1005X55N]  (hidden comment: GCM1555C1H221FA16D)
C40  value 4.7pF  [CAPC1005X55N]  (hidden comment: GJM1555C1H4R7WB01D)
C42  value 150pF  [CAPC1005X55N]  (hidden comment: GRM1555C1H151FA01D)
C43  value 4.7pF  [CAPC1005X55N]  (hidden comment: GJM1555C1H4R7WB01D)
C46  value 220pF  [CAPC1005X55N]  (hidden comment: GCM1555C1H221FA16D)
C49  value 150pF  [CAPC1005X55N]  (hidden comment: GRM1555C1H151FA01D)
C50  value 4.7pF  [CAPC1005X55N]  (hidden comment: GJM1555C1H4R7WB01D)
C53  value 220pF  [CAPC1005X55N]  (hidden comment: GCM1555C1H221FA16D)
C56  value 150pF  [CAPC1005X55N]  (hidden comment: GRM1555C1H151FA01D)
C57  value 4.7pF  [CAPC1005X55N]  (hidden comment: GJM1555C1H4R7WB01D)
C60  value 220pF  [CAPC1005X55N]  (hidden comment: GCM1555C1H221FA16D)
C63  value 150pF  [CAPC1005X55N]  (hidden comment: GRM1555C1H151FA01D)
C64  value 4.7pF  [CAPC1005X55N]  (hidden comment: GJM1555C1H4R7WB01D)
C67  value 220pF  [CAPC1005X55N]  (hidden comment: GCM1555C1H221FA16D)
C70  value 150pF  [CAPC1005X55N]  (hidden comment: GRM1555C1H151FA01D)
C71  value 4.7pF  [CAPC1005X55N]  (hidden comment: GJM1555C1H4R7WB01D)
LED1  APA1606SURCK  [Kingbright_SMD_2_RWH]
LED2  APA1606SURCK  [Kingbright_SMD_2_RWH]
LED3  APA1606SURCK  [Kingbright_SMD_2_RWH]
LED4  APA1606SURCK  [Kingbright_SMD_2_RWH]
LED5  APA1606SURCK  [Kingbright_SMD_2_RWH]
LED6  APA1606SURCK  [Kingbright_SMD_2_RWH]
LED7  APA1606SURCK  [Kingbright_SMD_2_RWH]
LED8  APA1606SURCK  [Kingbright_SMD_2_RWH]
R6  value 68R  [RESC1005X40N]  (hidden comment: CRGP0402F68R)
R7  value 68R  [RESC1005X40N]  (hidden comment: CRGP0402F68R)
R8  value 620  [RESC1005X40N]  (hidden comment: ERJ-2RKF6200X)
R9  value 620  [RESC1005X40N]  (hidden comment: ERJ-2RKF6200X)
R10  value 68R  [RESC1005X40N]  (hidden comment: CRGP0402F68R)
R11  value 68R  [RESC1005X40N]  (hidden comment: CRGP0402F68R)
R12  value 68R  [RESC1005X40N]  (hidden comment: CRGP0402F68R)
R13  value 68R  [RESC1005X40N]  (hidden comment: CRGP0402F68R)
R14  value 68R  [RESC1005X40N]  (hidden comment: CRGP0402F68R)
R15  value 68R  [RESC1005X40N]  (hidden comment: CRGP0402F68R)
R17  value 620  [RESC1005X40N]  (hidden comment: ERJ-2RKF6200X)
R19  value 620  [RESC1005X40N]  (hidden comment: ERJ-2RKF6200X)
R21  value 620  [RESC1005X40N]  (hidden comment: ERJ-2RKF6200X)
R23  value 620  [RESC1005X40N]  (hidden comment: ERJ-2RKF6200X)
R25  value 620  [RESC1005X40N]  (hidden comment: ERJ-2RKF6200X)
R27  value 620  [RESC1005X40N]  (hidden comment: ERJ-2RKF6200X)
U3  74AHC595BQ,115  [NexperiaUSAInc_16-VFQFN_16_R]
U4  SN74CBTLV3251  [TexasInstruments_16-VFQFN_16_R]
U5  antenna  [antenna_1_layer]  (net tie)
U6  antenna  [antenna_1_layer]  (net tie)
U7  antenna  [antenna_1_layer]  (net tie)
U9  antenna  [antenna_1_layer]  (net tie)
U11  antenna  [antenna_1_layer]  (net tie)
U13  antenna  [antenna_1_layer]  (net tie)
U15  antenna  [antenna_1_layer]  (net tie)
U17  antenna  [antenna_1_layer]  (net tie)

### Ports
3V3, GND (bidir), HF (bidir), LedCLK (in), LedDataIn (in), LedDataOut (out), LedLoad (in), OE (in), S01 (in), S02 (in), S03 (in)

### Nets
3V3: C28.2 C30.2 U3.10(~{MR}) U3.16(VCC) U4.16(VCC) ; port 3V3
GND: C28.1 C30.1 C33.1(Pos) C34.1(Pos) C35.1(Pos) C36.1(Pos) C38.1(Pos) C40.1(Pos) C42.1(Pos) C43.1(Pos) C49.1(Pos) C50.1(Pos) C56.1(Pos) C57.1(Pos) C63.1(Pos) C64.1(Pos) C70.1(Pos) C71.1(Pos) LED1.1(K) LED2.1(K) LED3.1(K) LED4.1(K) LED5.1(K) LED6.1(K) LED7.1(K) LED8.1(K) R8.1 R9.1 R17.1 R19.1 R21.1 R23.1 R25.1 R27.1 U3.8(GND) U3.13(~{OE}) U3.17(GND) U4.8(GND) U4.17(GND) U5.2 U6.2 U7.2 U9.2 U11.2 U13.2 U15.2 U17.2 ; port GND
B11: C31.1(Pos) U4.4(B1)
B12: C37.1(Pos) U4.3(B2)
B13: C32.1(Pos) U4.2(B3)
B14: C39.1(Pos) U4.1(B4)
B15: C46.1(Pos) U4.15(B5)
B16: C53.1(Pos) U4.14(B6)
B17: C60.1(Pos) U4.13(B7)
B18: C67.1(Pos) U4.12(B8)
HF: U4.5(A) ; port HF
Led1: R15.1 U3.15(Q0)
Led2: R14.1 U3.1(Q1)
Led3: R13.1 U3.2(Q2)
Led4: R12.1 U3.3(Q3)
Led5: R11.1 U3.4(Q4)
Led6: R10.1 U3.5(Q5)
Led7: R6.1 U3.6(Q6)
Led8: R7.1 U3.7(Q7)
LedCLK: U3.11(SHCP) ; port LedCLK
LedDataIn: U3.14(DS) ; port LedDataIn
LedDataOut: U3.9(Q7S) ; port LedDataOut
LedLoad: U3.12(STCP) ; port LedLoad
OE: U4.7(~{OE}) ; port OE
S01: U4.11(S0) ; port S01
S02: U4.10(S1) ; port S02
S03: U4.9(S2) ; port S03
NetC31_2: C31.2(Neg) C33.2(Neg) C34.2(Neg) R8.2 U5.1
NetC32_2: C32.2(Neg) C35.2(Neg) C36.2(Neg) R17.2 U7.1
NetC37_2: C37.2(Neg) C38.2(Neg) C40.2(Neg) R9.2 U6.1
NetC39_2: C39.2(Neg) C42.2(Neg) C43.2(Neg) R19.2 U9.1
NetC46_2: C46.2(Neg) C49.2(Neg) C50.2(Neg) R21.2 U11.1
NetC53_2: C53.2(Neg) C56.2(Neg) C57.2(Neg) R23.2 U13.1
NetC60_2: C60.2(Neg) C63.2(Neg) C64.2(Neg) R25.2 U15.1
NetC67_2: C67.2(Neg) C70.2(Neg) C71.2(Neg) R27.2 U17.1
NetLED1_2: LED1.2(A) R6.2
NetLED2_2: LED2.2(A) R10.2
NetLED3_2: LED3.2(A) R11.2
NetLED4_2: LED4.2(A) R12.2
NetLED5_2: LED5.2(A) R13.2
NetLED6_2: LED6.2(A) R14.2
NetLED7_2: LED7.2(A) R15.2
NetLED8_2: LED8.2(A) R7.2

### Channels
A: designators end in _A; ports 3V3=3V3 GND=GND HF=HF LedCLK=LedCLK LedDataIn=LedDataIn LedDataOut=LedDataIn LedLoad=LedLoad OE=OE S01=S01 S02=S02 S03=S03
B: designators end in _B; ports 3V3=3V3 GND=GND HF=HF LedCLK=LedCLK LedDataIn=LedDataIn LedDataOut=LedDataIn LedLoad=LedLoad OE=OE S01=S01 S02=S02 S03=S03
C: designators end in _C; ports 3V3=3V3 GND=GND HF=HF LedCLK=LedCLK LedDataIn=LedDataIn LedDataOut=LedDataOut_C LedLoad=LedLoad OE=OE S01=S01 S02=S02 S03=S03

### Notes on the sheet
- Led Ansteuerung
- Antennen Ansteuerung
- Nominaler Strom: 10mA
- Title
- Size:
- Date:
- A3
- Number:
- Time:
- Revision:
- Sheet
- of
- File:

### Library data of the parts
C28 C30 = CMP-1033-00660-1: 0.1µF ±10% 10V Ceramic Capacitor X5R 0402 (1005 Metric); Manufacturer: Taiyo Yuden; Case-Metric: 0603; Case-EIA: 0201; Rated Voltage: 6.3 V; Tolerance: Â±10%; Max Thickness: 0.33 mm; Technology: SMT; Manufacturer PartNr: LMK105BJ104KV-F
C31 C32 C37 C39 C46 C53 C60 C67 = 706xx_R+M_InteliPhyII_KTI-00070-A.1: 220pF ±1% 50V Ceramic Capacitor C0G, NP0 0402 (1005 Metric); Manufacturer: Murata Electronics; Manufacturer PartNr: GRM033R71E122KA01D
C33 C35 C38 C42 C49 C56 C63 C70 = 706xx_R+M_InteliPhyII_KTI-00069-A.1: 150pF ±1% 50V Ceramic Capacitor C0G, NP0 0402 (1005 Metric); Manufacturer: Murata Electronics North America; Manufacturer PartNr: GRM1555C1H151FA01D
C34 C36 C40 C43 C50 C57 C64 C71 = 706xx_R+M_InteliPhyII_KTI-00023-A.1: 4.7pF ±0.05pF 50V Ceramic Capacitor C0G, NP0 0402 (1005 Metric); Manufacturer: Murata Electronics North America; Manufacturer PartNr: GJM1555C1H4R7WB01D
LED1-LED8 = 706xx_R+M_InteliPhyII_KTI-00048-A.2: Red 630nm LED Indication - Discrete 1.95V 2-SMD, No Lead; Manufacturer: Kingbright; ShortDescription: Description (used in sheet); Manufacturer PartNr: APA1606SURCK
R6 R7 R10-R15 = PassResBas0201-00055-A.2: 68 Ohms ±1% 0.125W, 1/8W Chip Resistor 0402 (1005 Metric) Pulse Withstanding Thick Film; Manufacturer: TE Connectivity Passive Product; #ClassSub: Resistor SMD; #Class: Passiv-Components; Status: nLager; Manufacturer PartNr: CRGP0402F68R
R8 R9 R17 R19 R21 R23 R25 R27 = PassResBas0201-00055-A.2: 620 Ohms ±1% 0.1W, 1/10W Chip Resistor 0402 (1005 Metric) Automotive AEC-Q200 Thick Film; Manufacturer: Panasonic Electronic Components; #ClassSub: Resistor SMD; #Class: Passiv-Components; Status: nLager; Manufacturer PartNr: ERJ-2RKF6200X
U3 = NexperiaUSAInc_74AHC595,115_16-VFQFN_16: IC 8BIT SHIFT REGISTER 16HVQFN; Manufacturer: Nexperia USA Inc.; Manufacturer PartNr: 74AHC595BQ,115
U4 = SN74CBTLV3251RGYR: Multiplexer Switch ICs Sngl-Pole Dbl-Throw Analog Switch; Manufacturer: Texas Instruments; Replaceable: no; Manufacturer PartNr: SN74CBTLV3251RGYR; ComponentLink1Description: mouser; ComponentLink1URL: https://www.mouser.ch/ProductDetail/Texas-Instruments/SN74CBTLV3251RGYR?qs=%2fha2pyFaduj0jkaZeFbDsRaCQjjoxFIhZ%2frFxSESrMpT%252bYmeDnewIw%3d%3d; Footprint/Package: VQFN-16; Supplier 1: Mouser; Supplier 2: Digi-Key; Supplier Part Number 1: 595-SN74CBTLV3251RGY; Supplier Part Number 2: 296-15105-6-ND
U5-U7 U9 U11 U13 U15 U17 = antenna: Replaceable: no; Footprint/Package: *